# EAGLE schematic star-tracker-card (EAGLE 9.6.1)

## Sheet 1 of 5: Connectors
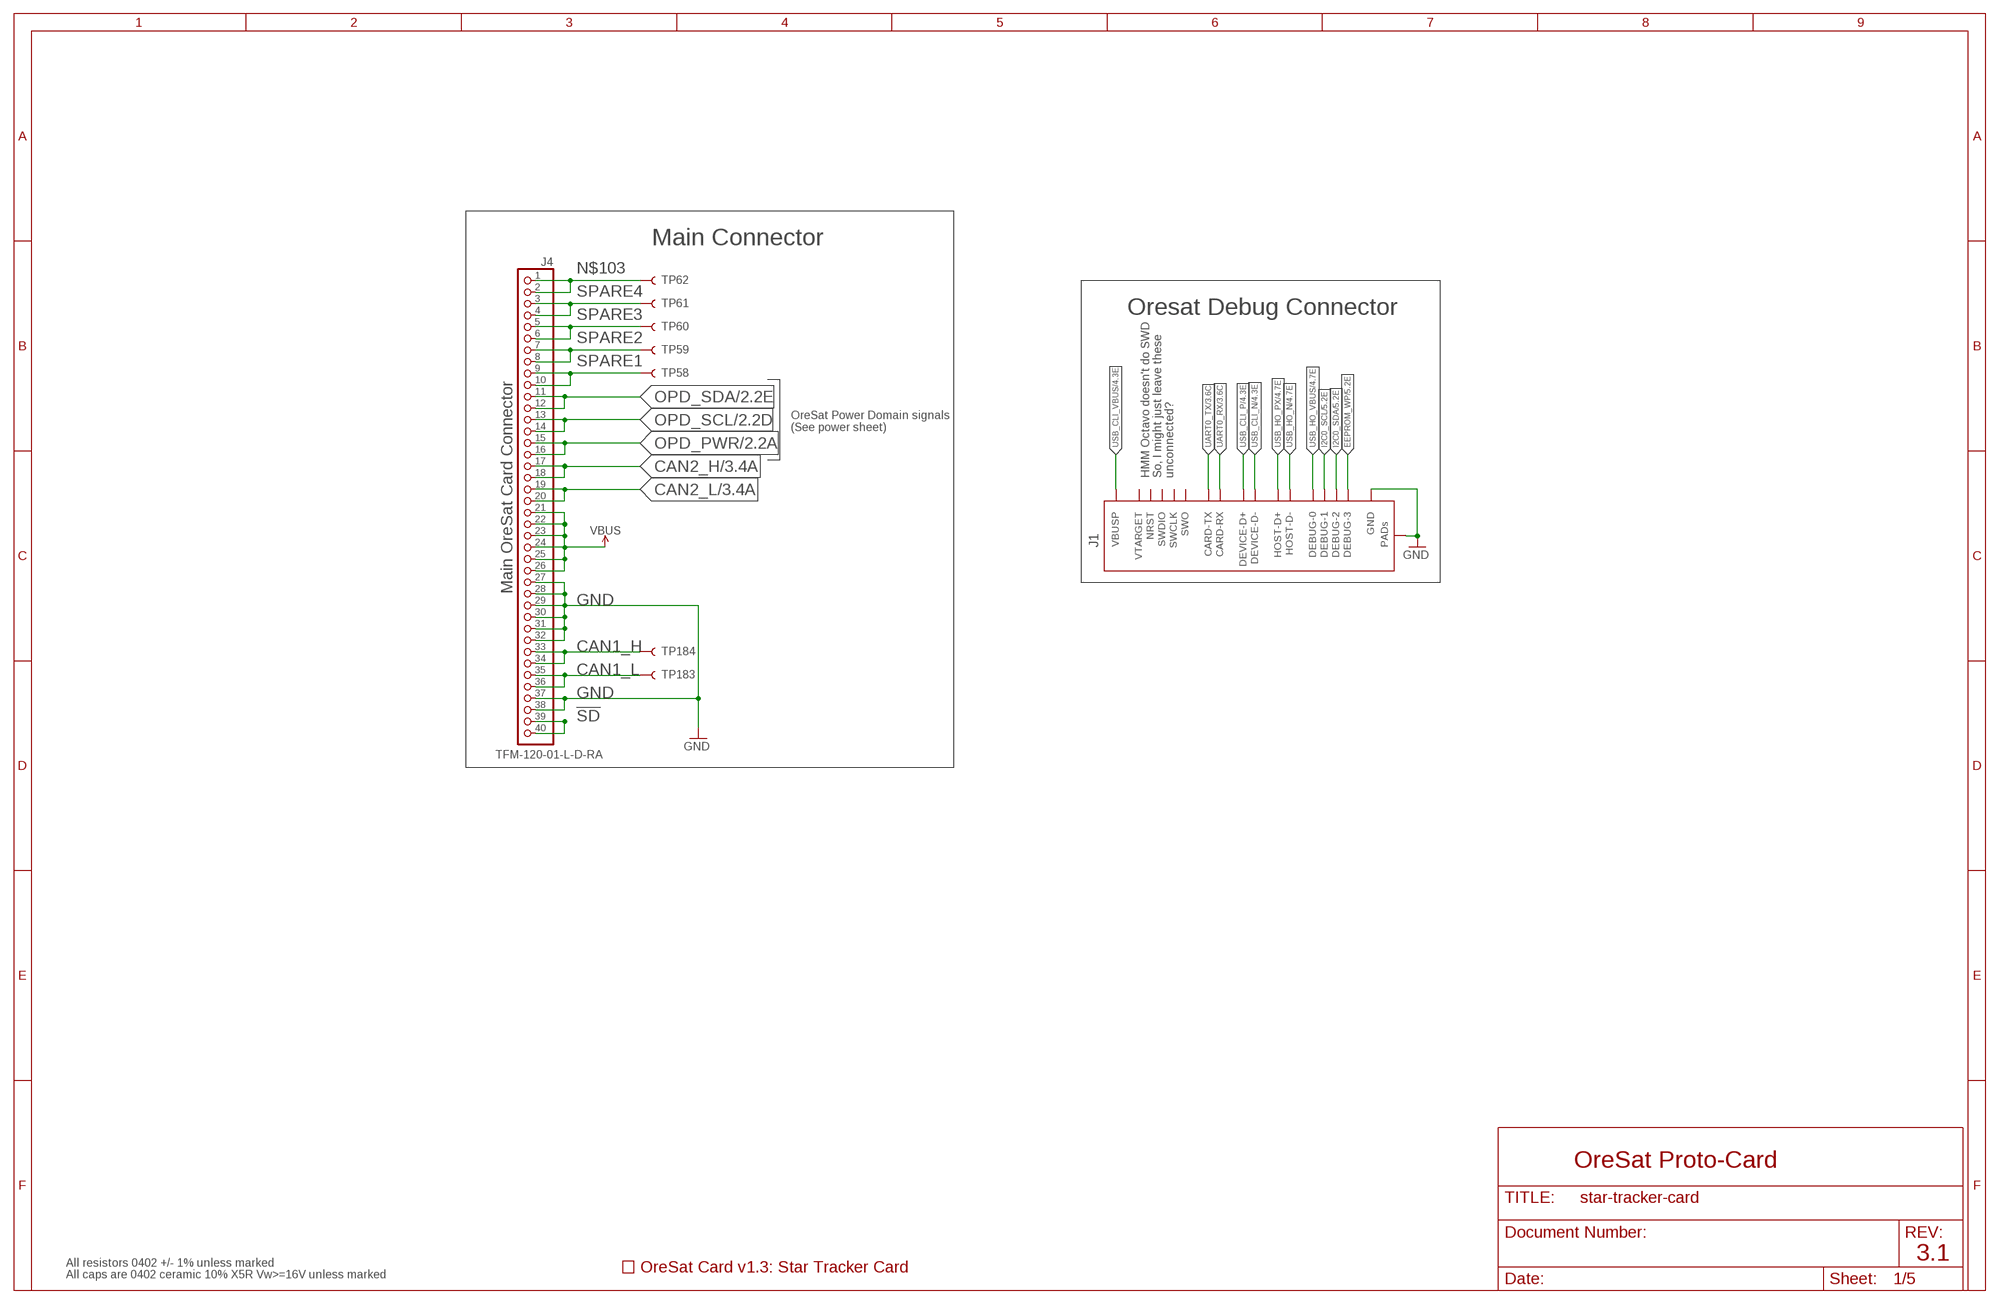
[diagram p0: schematic, sheet 1]

### Parts
J1  ORESAT-DEBUG-CONNECTOR-CARD  [TE_2-1734592-0]
J4  TFM-120-01-L-D-RA  J-SAMTEC-TFM-120-X1-XXX-D-RA  [J-SAMTEC-TFM-120-X1-XXX-D-RA]
PCB1  ORESAT-CARD-V1.3-STAR-TRACKER  [ORESAT-CARD-V1.3-STAR-TRACKER]
TP58  TEST-POINT3X4  [PAD.03X.04]
TP59  TEST-POINT3X4  [PAD.03X.04]
TP60  TEST-POINT3X4  [PAD.03X.04]
TP61  TEST-POINT3X4  [PAD.03X.04]
TP62  TEST-POINT3X4  [PAD.03X.04]
TP183  TEST-POINT3X4  [PAD.03X.04]
TP184  TEST-POINT3X4  [PAD.03X.04]

### Nets
!SD: J4.39 J4.40
CAN1_H: J4.33 J4.34 TP184.P$1
CAN1_L: J4.35 J4.36 TP183.P$1
CAN2_H: J4.17 J4.18 ; also sheet 3
CAN2_L: J4.19 J4.20 ; also sheet 3
EEPROM_WP: J1.20(DEBUG-3) ; also sheet 5
GND: J1.3(GND) J1.6(GND) J1.9(GND) J1.PAD1(PAD) J1.PAD2(PAD) J4.27 J4.28 J4.29 J4.30 J4.31 J4.32 J4.37 J4.38 ; also sheet 2,3,4,5
I2C0_SCL: J1.18(DEBUG-1) ; also sheet 5
I2C0_SDA: J1.19(DEBUG-2) ; also sheet 5
N$103: J4.1 J4.2 TP62.P$1
OPD_PWR: J4.15 J4.16 ; also sheet 2
OPD_SCL: J4.13 J4.14 ; also sheet 2
OPD_SDA: J4.11 J4.12 ; also sheet 2
SPARE1: J4.9 J4.10 TP58.P$1
SPARE2: J4.7 J4.8 TP59.P$1
SPARE3: J4.5 J4.6 TP60.P$1
SPARE4: J4.3 J4.4 TP61.P$1
UART0_RX: J1.12(CARD-RX) ; also sheet 3
UART0_TX: J1.13(CARD-TX) ; also sheet 3
USB_CLI_N: J1.5(DEVICE-D-) ; also sheet 4
USB_CLI_P: J1.4(DEVICE-D+) ; also sheet 4
USB_CLI_VBUS: J1.1(VBUSP) J1.2(VBUSP) ; also sheet 4
USB_HO_N: J1.8(HOST-D-) ; also sheet 4
USB_HO_PX: J1.7(HOST-D+) ; also sheet 4
USB_HO_VBUS: J1.17(DEBUG-0) ; also sheet 4
VBUS: J4.21 J4.22 J4.23 J4.24 J4.25 J4.26 ; also sheet 2
Unconnected: J1.10(NRST) J1.11(VTARGET) J1.14(SWDIO) J1.15(SWCLK) J1.16(SWO)

### Notes on the sheet
- Main Connector
- Oresat Debug Connector
- OreSat Power Domain signals
  (See power sheet)
- HMM Octavo doesn't do SWD
  So, I might just leave these 
  unconnected?
- Main OreSat Card Connector
- OreSat Proto-Card
- 3.1
- All resistors 0402 +/- 1% unless marked
- All caps are 0402 ceramic 10% X5R Vw>=16V unless marked

## Sheet 2 of 5: Power
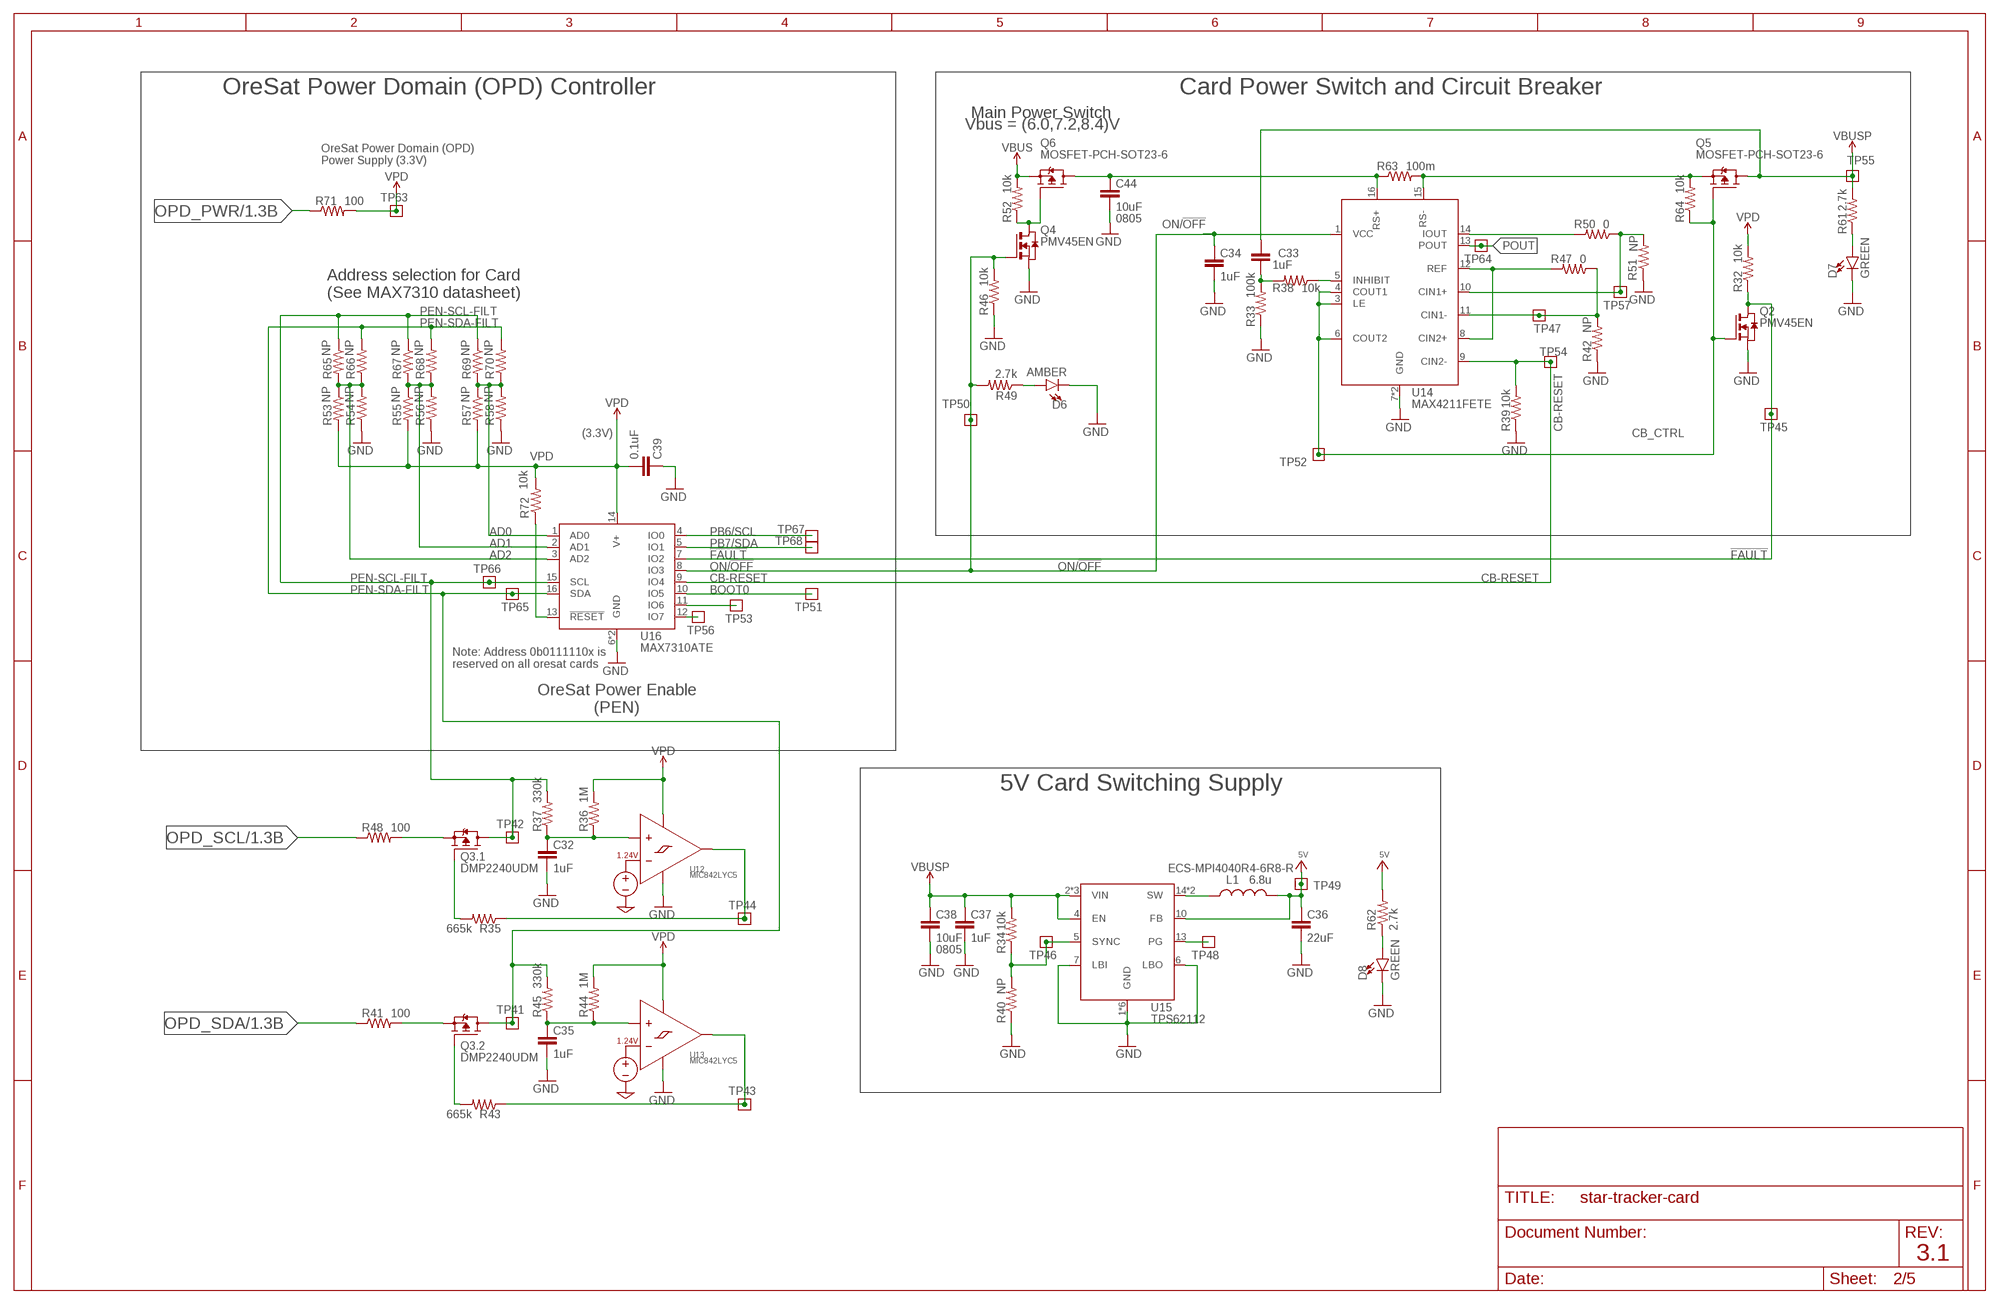
[diagram p1: schematic, sheet 2]

### Parts
C32  1uF  C-EU0805-B-NOSILK  [.0805-B-NOSILK]
C33  1uF  C-EU0603-A  [.0603-A]
C34  1uF  C-EU0603-A  [.0603-A]
C35  1uF  C-EU0805-B-NOSILK  [.0805-B-NOSILK]
C36  22uF  C-EUC1210  [C1210]
C37  1uF  C-EU0603-A  [.0603-A]
C38  10uF  C-EU0805-B  [.0805-B]
C39  0.1uF  C-EU0603-A  [.0603-A]
C44  10uF  C-EU0805-B  [.0805-B]
D6  AMBER  LED-GREEN0603  [LED-0603]
D7  GREEN  LED-GREEN0603  [LED-0603]
D8  GREEN  LED-GREEN0603  [LED-0603]
L1  6.8u  L-ECS-MPI4040  [ECS-MPI4040]
Q2  PMV45EN  [SOT23]
Q3  DMP2240UDM  MOSFET-PCH-SOT23-6  [SOT23-6]
Q4  PMV45EN  [SOT23]
Q5  MOSFET-PCH-SOT23-6  [SOT23-6]
Q6  MOSFET-PCH-SOT23-6  [SOT23-6]
R32  10k  R-US_0603-A  [.0603-A]
R33  100k  R-US_0603-A  [.0603-A]
R34  10k  R-US_0603-A  [.0603-A]
R35  665k  R-US_0603-A  [.0603-A]
R36  1M  R-US_0603-A  [.0603-A]
R37  330k  R-US_0603-A  [.0603-A]
R38  10k  R-US_0603-A  [.0603-A]
R39  10k  R-US_0603-A  [.0603-A]
R40  NP  R-US_0603-A  [.0603-A]
R41  100  R-US_0603-A  [.0603-A]
R42  NP  R-US_0603-A  [.0603-A]
R43  665k  R-US_0603-A  [.0603-A]
R44  1M  R-US_0603-A  [.0603-A]
R45  330k  R-US_0603-A  [.0603-A]
R46  10k  R-US_0603-A  [.0603-A]
R47  0  R-US_0603-A  [.0603-A]
R48  100  R-US_0603-A  [.0603-A]
R49  2.7k  R-US_0603-A  [.0603-A]
R50  0  R-US_0603-A  [.0603-A]
R51  NP  R-US_0603-A  [.0603-A]
R52  10k  R-US_0603-A  [.0603-A]
R53  NP  R-US_0603-A  [.0603-A]
R54  NP  R-US_0603-A  [.0603-A]
R55  NP  R-US_0603-A  [.0603-A]
R56  NP  R-US_0603-A  [.0603-A]
R57  NP  R-US_0603-A  [.0603-A]
R58  NP  R-US_0603-A  [.0603-A]
R61  2.7k  R-US_0603-A  [.0603-A]
R62  2.7k  R-US_0603-A  [.0603-A]
R63  100m  R-US_R1206  [R1206]
R64  10k  R-US_0603-A  [.0603-A]
R65  NP  R-US_0603-A  [.0603-A]
R66  NP  R-US_0603-A  [.0603-A]
R67  NP  R-US_0603-A  [.0603-A]
R68  NP  R-US_0603-A  [.0603-A]
R69  NP  R-US_0603-A  [.0603-A]
R70  NP  R-US_0603-A  [.0603-A]
R71  100  R-US_0603-A  [.0603-A]
R72  10k  R-US_0603-A  [.0603-A]
TP41  TEST-POINT  [2MM-TEST-POINT]
TP42  TEST-POINT  [2MM-TEST-POINT]
TP43  TEST-POINT  [2MM-TEST-POINT]
TP44  TEST-POINT  [2MM-TEST-POINT]
TP45  TEST-POINT  [2MM-TEST-POINT]
TP46  TEST-POINT  [2MM-TEST-POINT]
TP47  TEST-POINT  [2MM-TEST-POINT]
TP48  TEST-POINT  [2MM-TEST-POINT]
TP49  TEST-POINT  [2MM-TEST-POINT]
TP50  TEST-POINT  [2MM-TEST-POINT]
TP51  TEST-POINT  [2MM-TEST-POINT]
TP52  TEST-POINT  [2MM-TEST-POINT]
TP53  TEST-POINT  [2MM-TEST-POINT]
TP54  TEST-POINT  [2MM-TEST-POINT]
TP55  TEST-POINT  [2MM-TEST-POINT]
TP56  TEST-POINT  [2MM-TEST-POINT]
TP57  TEST-POINT  [2MM-TEST-POINT]
TP63  TEST-POINT  [2MM-TEST-POINT]
TP64  TEST-POINT  [2MM-TEST-POINT]
TP65  TEST-POINT  [2MM-TEST-POINT]
TP66  TEST-POINT  [2MM-TEST-POINT]
TP67  TEST-POINT  [2MM-TEST-POINT]
TP68  TEST-POINT  [2MM-TEST-POINT]
U12  MIC842LYC5  [SC70-5]
U13  MIC842LYC5  [SC70-5]
U14  MAX4211FETE  MAX4211  [QFN65P400X400X80-17T210]
U15  TPS62112  TPS6211X  [S-PVQFN-16]
U16  MAX7310ATE  MAX7310  [QFN65P400X400X80-17T210]

### Nets
5V: C36.1 L1.2 R62.2 TP49.1 U15.10(FB) ; also sheet 5
!FAULT: Q2.3(D) R32.1 TP45.1 U16.7(IO2)
AD0: R57.1 R58.2 R69.2 R70.1 U16.1(AD0)
AD1: R55.1 R56.2 R67.2 R68.1 U16.2(AD1)
AD2: R53.1 R54.2 R65.2 R66.1 U16.3(AD2)
BOOT0: TP51.1 U16.10(IO5)
CB-RESET: R39.2 TP54.1 U14.9(CIN2-) U16.9(IO4)
CB_CTRL: Q2.1(G) Q5.3(G) R64.1 TP52.1 U14.3(LE) U14.4(COUT1) U14.6(COUT2)
GND: C32.2 C34.2 C35.2 C36.2 C37.2 C38.2 C39.1 C44.2 D6.C D7.C D8.C Q2.2(S) Q4.2(S) R33.1 R39.1 R40.1 R42.1 R46.1 R51.1 R54.1 R56.1 R58.1 U12.2(GND) U13.2(GND) U14.7(GND) U14.EPAD(GND) U15.1(GND) U15.6(LBO) U15.7(LBI) U15.9(GND) U15.11(GND) U15.12(GND) U15.16(GND) U15.PAD(GND) U16.6(GND) U16.EPAD(GND) ; also sheet 1,3,4,5
IOUT: R50.2 U14.14(IOUT)
N$25: C32.1 R36.1 R37.1 U12.1(INP)
N$27: R35.1 TP44.1 U12.4(OUT)
N$32: TP56.1 U16.12(IO7)
N$98: C44.1 Q6.1(D) Q6.2(D) Q6.5(D) Q6.6(D) R63.1 U14.16(RS+)
N$99: Q5.4(S) R63.2 R64.2 U14.15(RS-)
N$100: C35.1 R44.1 R45.1 U13.1(INP)
N$113: Q3.3(.2:G) R43.2
N$117: Q3.1(.1:G) R35.2
N$270: D7.A R61.1
N$271: D8.A R62.1
N$385: TP53.1 U16.11(IO6)
N$479: Q3.5(.1:S) R48.2
N$575: D6.A R49.1
N$579: Q3.2(.2:S) R41.2
N$580: R43.1 TP43.1 U13.4(OUT)
N$589: R72.1 U16.13(!RESET)
N$590: Q4.3(D) Q6.3(G) R52.1
N$596: R50.1 R51.2 TP57.1 U14.10(CIN1+)
N$597: R42.2 R47.1 TP47.1 U14.11(CIN1-)
N$599: R47.2 U14.8(CIN2+) U14.12(REF)
N$603: C33.1 R33.2 R38.2
N$604: R38.1 U14.5(INHIBIT)
ON/!OFF: C34.1 Q4.1(G) R46.2 R49.2 TP50.1 U14.1(VCC) U16.8(IO3)
OPD_PWR: R71.1 ; also sheet 1
OPD_SCL: R48.1 ; also sheet 1
OPD_SDA: R41.1 ; also sheet 1
PB6/SCL: TP67.1 U16.4(IO0)
PB7/SDA: TP68.1 U16.5(IO1)
PEN-SCL-FILT: Q3.6(.1:D) R37.2 R65.1 R67.1 R69.1 TP42.1 TP66.1 U16.15(SCL)
PEN-SDA-FILT: Q3.4(.2:D) R45.2 R66.2 R68.2 R70.2 TP41.1 TP65.1 U16.16(SDA)
POUT: TP64.1 U14.13(POUT)
TPS62111-PG: TP48.1 U15.13(PG)
TPS62111-SYNC: R34.1 R40.2 TP46.1 U15.5(SYNC)
TPS62111_SW: L1.1 U15.14(SW) U15.15(SW)
VBUS: Q6.4(S) R52.2 ; also sheet 1
VBUSP: C33.2 C37.1 C38.1 Q5.1(D) Q5.2(D) Q5.5(D) Q5.6(D) R34.2 R61.2 TP55.1 U15.2(VIN) U15.3(VIN) U15.4(EN) U15.8(VIN)
VPD: C39.2 R32.2 R36.2 R44.2 R53.2 R55.2 R57.2 R71.2 R72.2 TP63.1 U12.5(VDD) U13.5(VDD) U16.14(V+)

### Notes on the sheet
- OreSat Power Domain (OPD) Controller | Card Power Switch and Circuit Breaker
- Main Power Switch
- Vbus = (6.0,7.2,8.4)V
- OreSat Power Domain (OPD)
  Power Supply (3.3V)
- 0805
- Address selection for Card
  (See MAX7310 datasheet)
- (3.3V)
- Note: Address 0b0111110x is 
  reserved on all oresat cards
- OreSat Power Enable
  (PEN)
- 5V Card Switching Supply
- ECS-MPI4040R4-6R8-R
- 0805
- 3.1

## Sheet 3 of 5: OSD3358 SD, eMMC, Camera, etc : SIP C, D
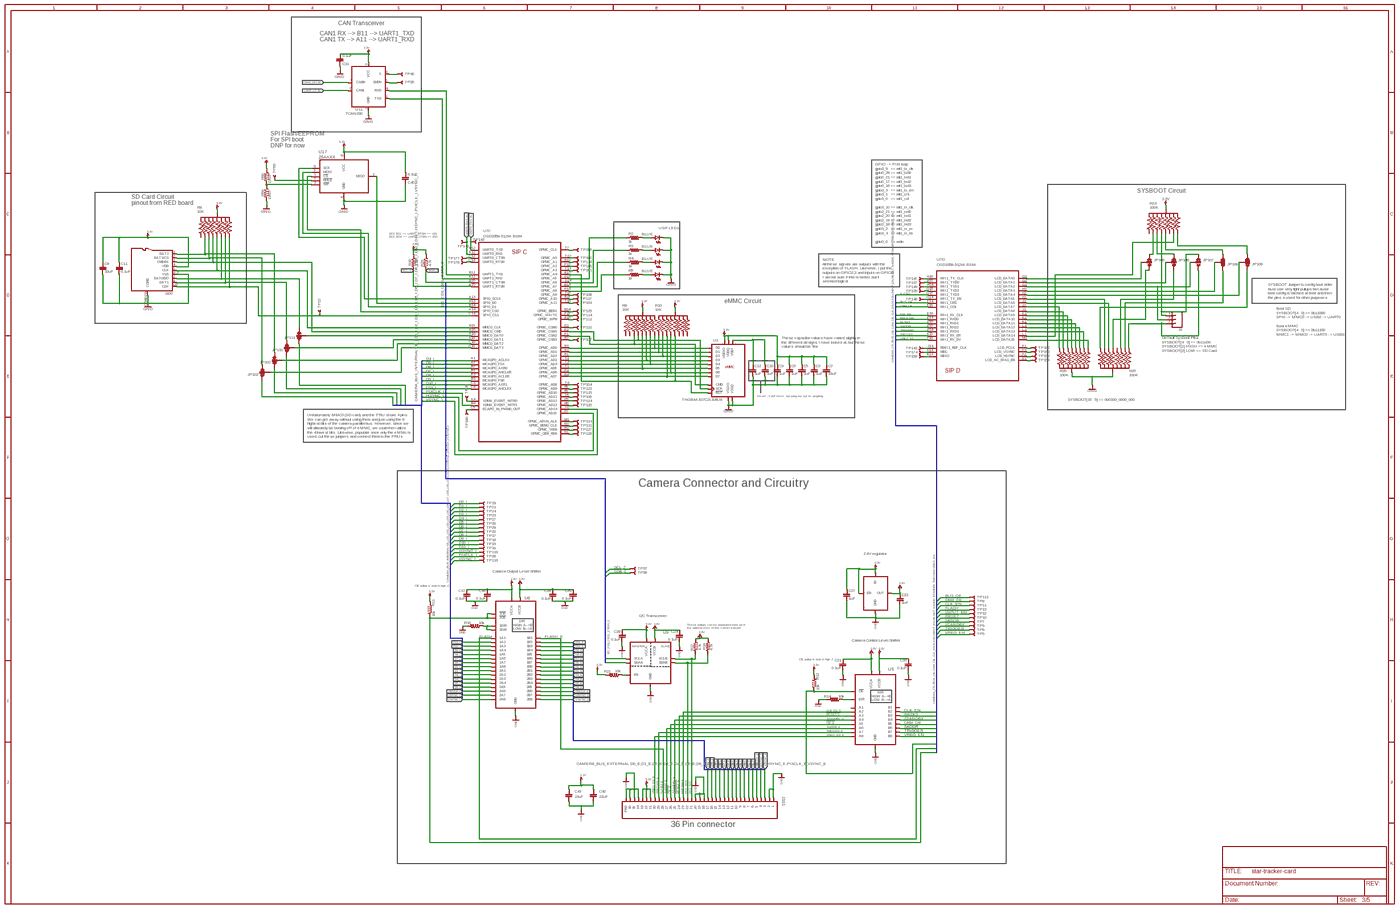
[diagram p2: schematic, sheet 3, overview]
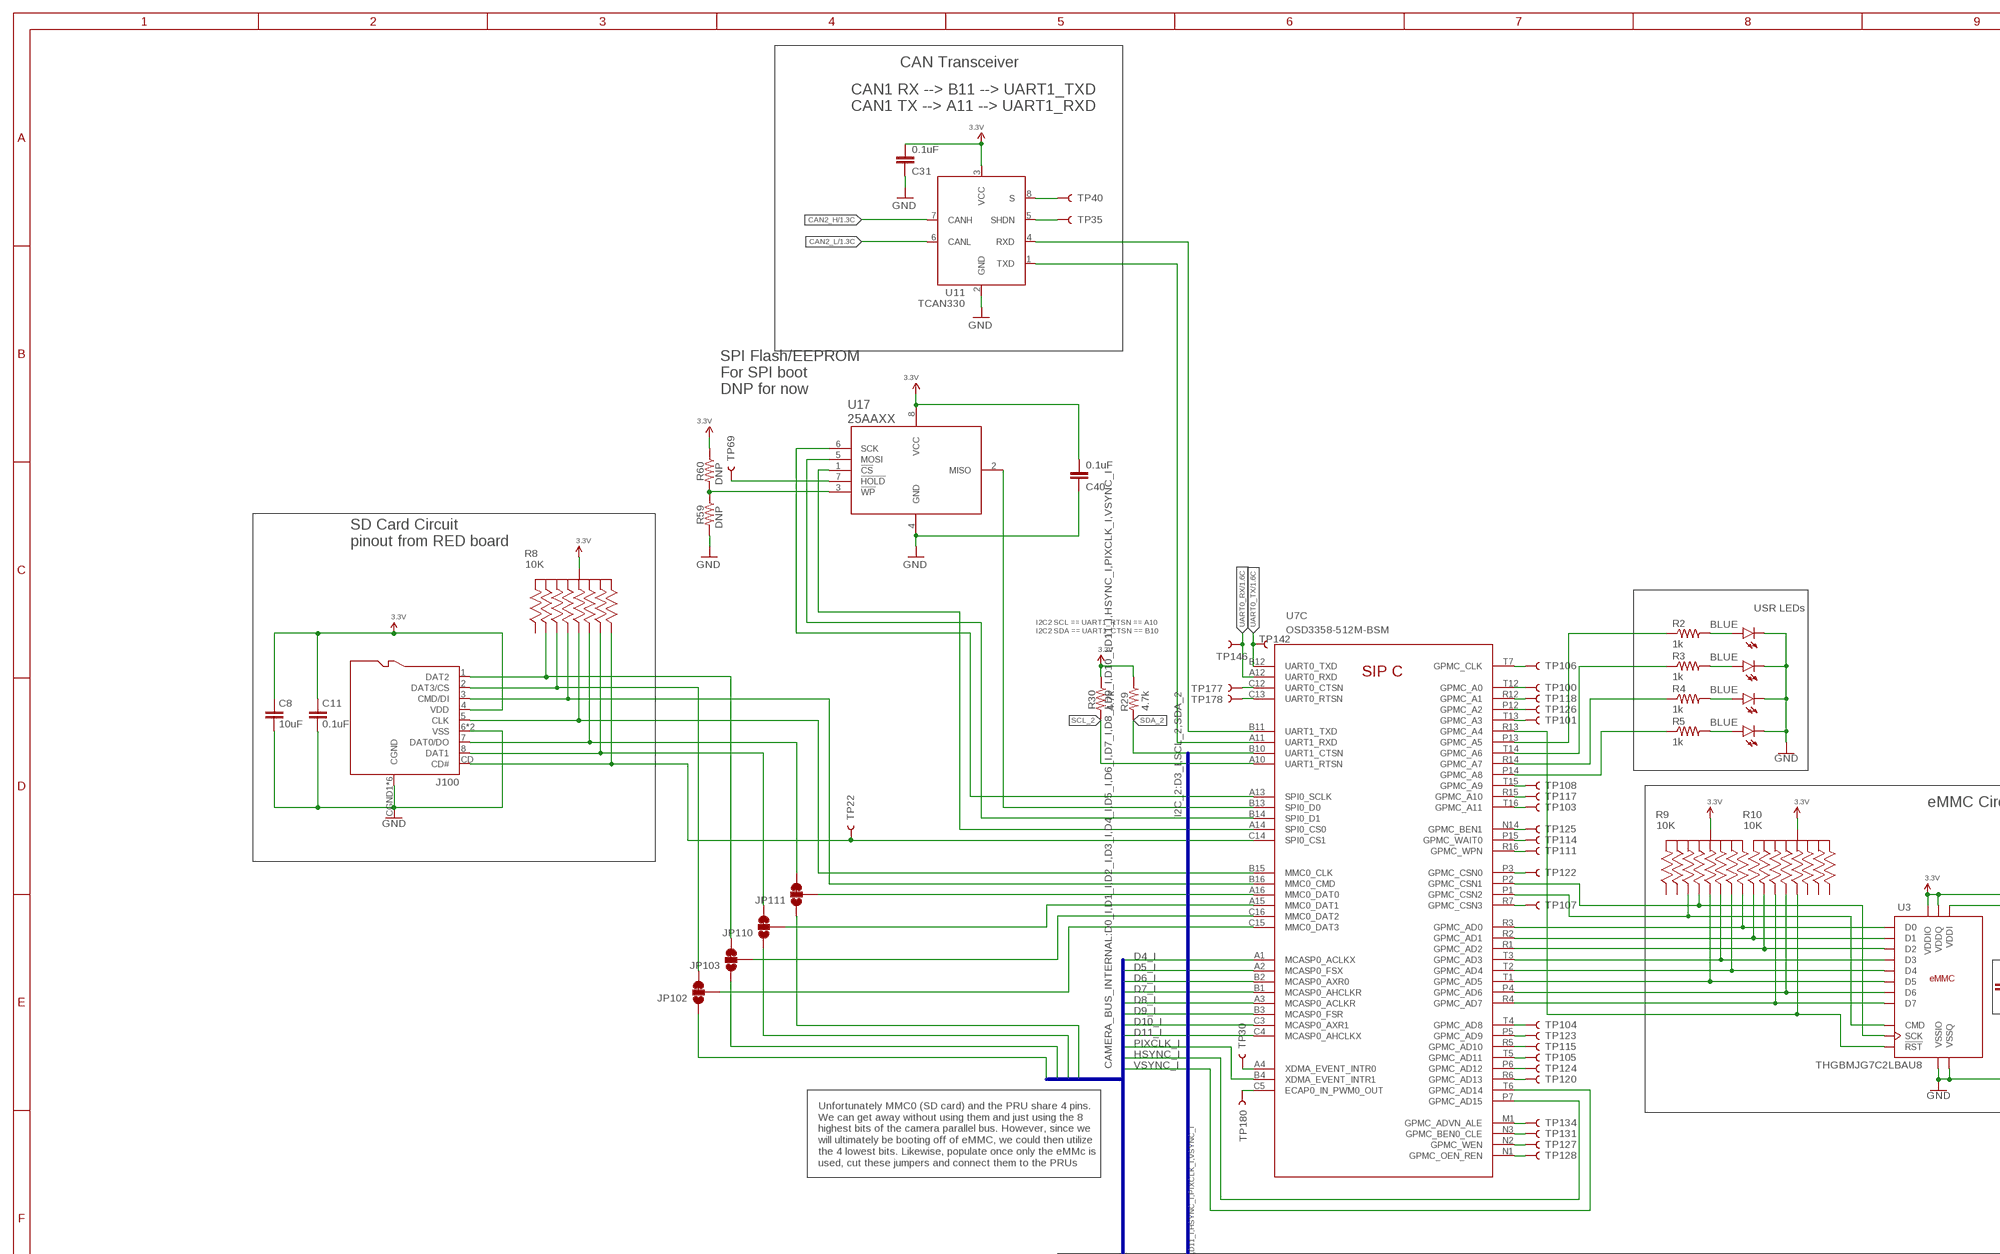
[diagram p3: schematic, sheet 3, part 1 of 4]
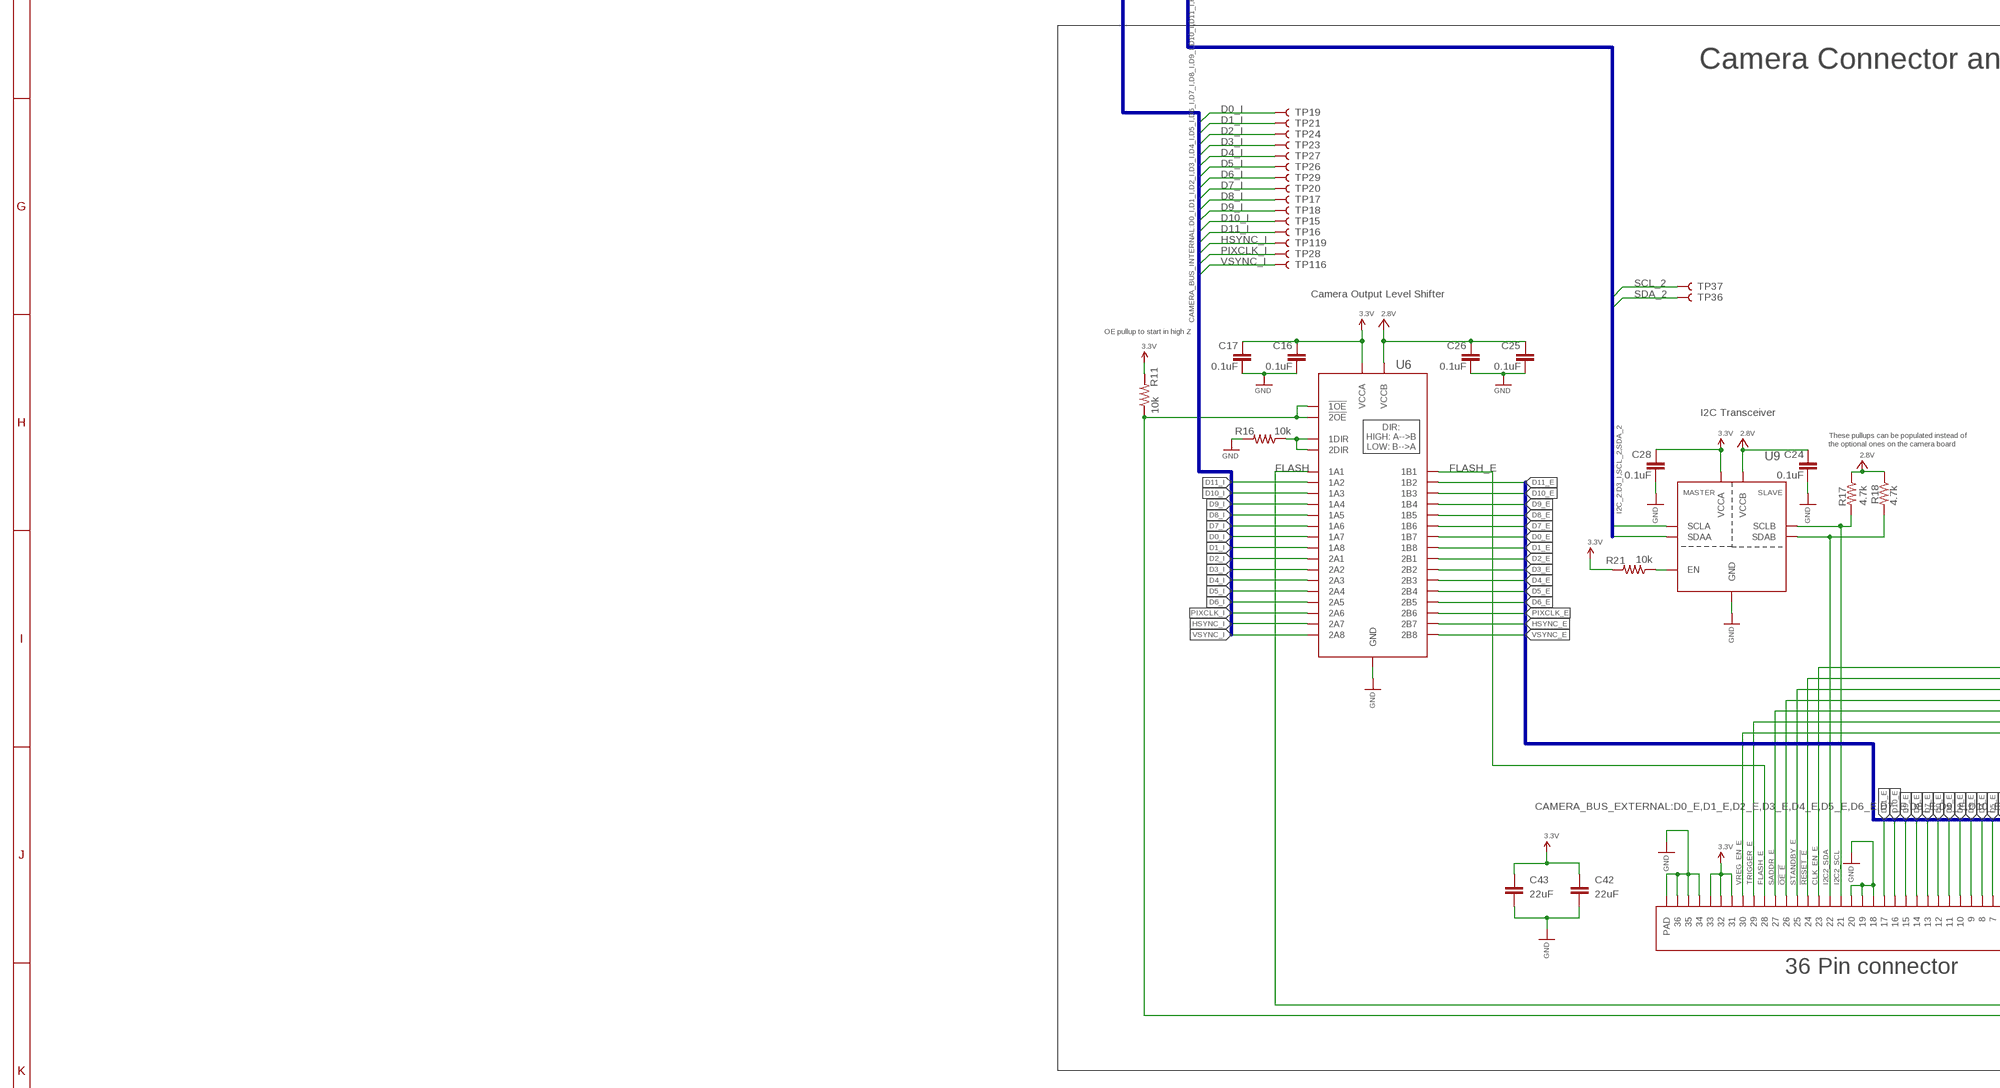
[diagram p4: schematic, sheet 3, part 2 of 4]
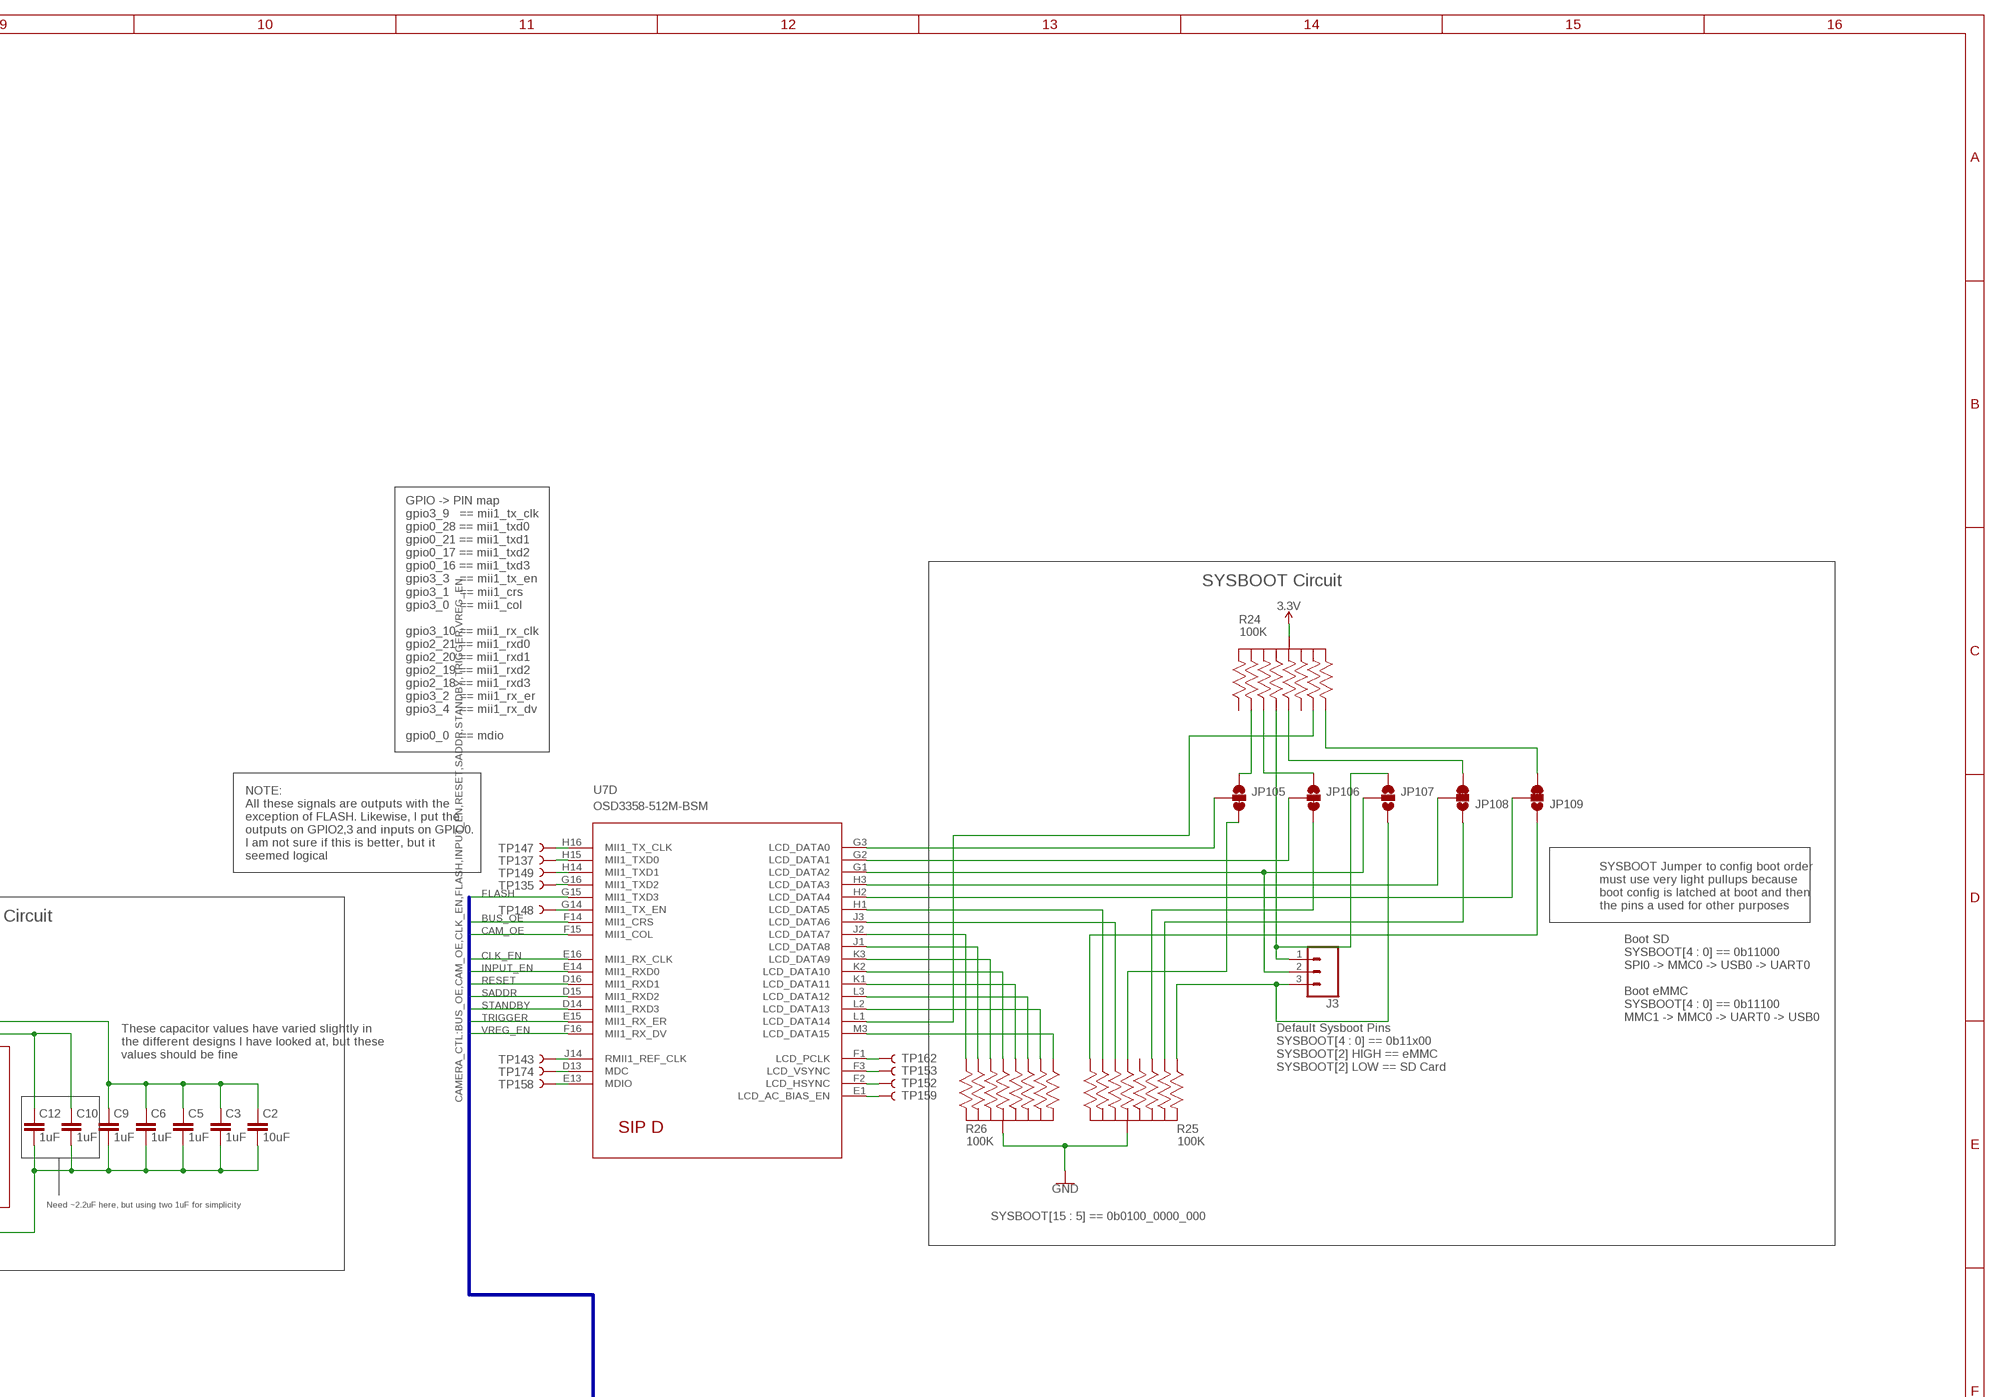
[diagram p5: schematic, sheet 3, part 3 of 4]
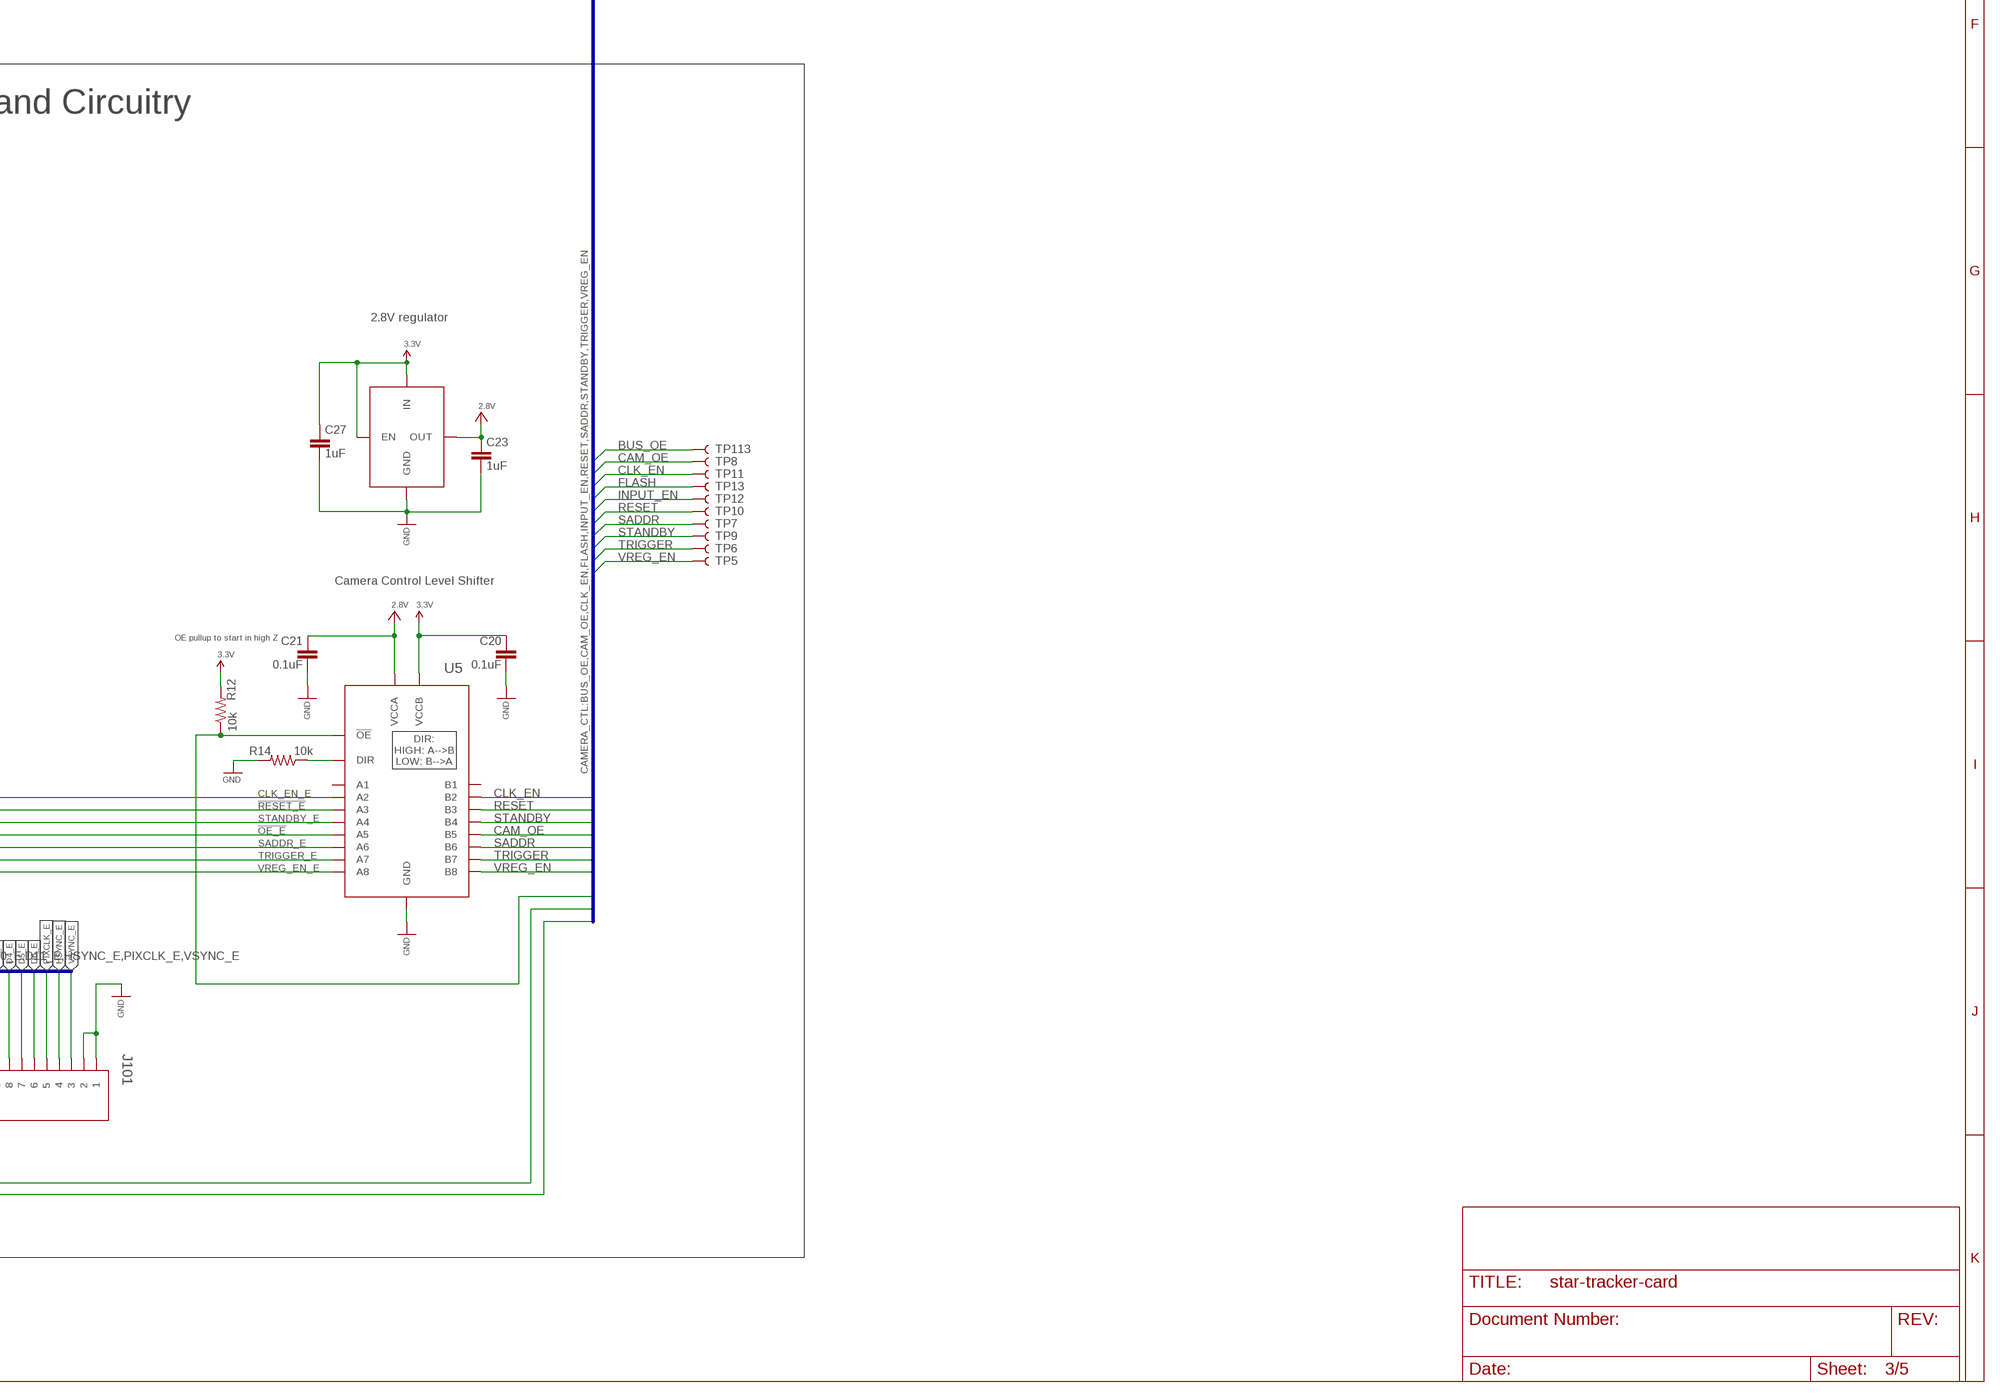
[diagram p6: schematic, sheet 3, part 4 of 4]

### Parts
C2  10uF  C-EU0805-B  [.0805-B]
C3  1uF  C-EU0603-A  [.0603-A]
C5  1uF  C-EU0603-A  [.0603-A]
C6  1uF  C-EU0603-A  [.0603-A]
C8  10uF  C-EU0805-B  [.0805-B]
C9  1uF  C-EU0603-A  [.0603-A]
C10  1uF  C-EU0603-A  [.0603-A]
C11  0.1uF  C-EU0603-A  [.0603-A]
C12  1uF  C-EU0603-A  [.0603-A]
C16  0.1uF  C-EU0603-A  [.0603-A]
C17  0.1uF  C-EU0603-A  [.0603-A]
C20  0.1uF  C-EU0603-A  [.0603-A]
C21  0.1uF  C-EU0603-A  [.0603-A]
C23  1uF  C-EU0603-A  [.0603-A]
C24  0.1uF  C-EU0603-A  [.0603-A]
C25  0.1uF  C-EU0603-A  [.0603-A]
C26  0.1uF  C-EU0603-A  [.0603-A]
C27  1uF  C-EU0603-A  [.0603-A]
C28  0.1uF  C-EU0603-A  [.0603-A]
C31  0.1uF  C-EU0603-A  [.0603-A]
C40  0.1uF  C-EU0603-A  [.0603-A]
C42  22uF  C-EUC1210  [C1210]
C43  22uF  C-EUC1210  [C1210]
D2  BLUE  LED-BLUE0603  [LED-0603]
D3  BLUE  LED-BLUE0603  [LED-0603]
D4  BLUE  LED-BLUE0603  [LED-0603]
D5  BLUE  LED-BLUE0603  [LED-0603]
J3  CONN_03LONGPADS  [1X03_LONGPADS]
J100  DM3BT-DSF-PEJS  [DM3BT-DSF-PEJS]
J101  3-1734592-64-1734592-0  [TE_3-1734592-6]
JP102  JUMPER-SMT_3_1-NC_TRACE_SILK  [SMT-JUMPER_3_1-NC_TRACE_SILK]
JP103  JUMPER-SMT_3_1-NC_TRACE_SILK  [SMT-JUMPER_3_1-NC_TRACE_SILK]
JP105  JUMPER-SMT_3_1-NC_TRACE_SILK  [SMT-JUMPER_3_1-NC_TRACE_SILK]
JP106  JUMPER-SMT_3_1-NC_TRACE_SILK  [SMT-JUMPER_3_1-NC_TRACE_SILK]
JP107  JUMPER-SMT_3_NO_SILK  [SMT-JUMPER_3_NO_SILK]
JP108  JUMPER-SMT_3_1-NC_TRACE_SILK  [SMT-JUMPER_3_1-NC_TRACE_SILK]
JP109  JUMPER-SMT_3_1-NC_TRACE_SILK  [SMT-JUMPER_3_1-NC_TRACE_SILK]
JP110  JUMPER-SMT_3_1-NC_TRACE_SILK  [SMT-JUMPER_3_1-NC_TRACE_SILK]
JP111  JUMPER-SMT_3_1-NC_TRACE_SILK  [SMT-JUMPER_3_1-NC_TRACE_SILK]
R2  1k  R-US_0603-A  [.0603-A]
R3  1k  R-US_0603-A  [.0603-A]
R4  1k  R-US_0603-A  [.0603-A]
R5  1k  R-US_0603-A  [.0603-A]
R8  10K  EXB-A10P391JC_ARRAY_EXBA-M  [ARRAY_EXBA-M]
R9  10K  EXB-A10P391JC_ARRAY_EXBA-M  [ARRAY_EXBA-M]
R10  10K  EXB-A10P391JC_ARRAY_EXBA-M  [ARRAY_EXBA-M]
R11  10k  R-US_0603-A  [.0603-A]
R12  10k  R-US_0603-A  [.0603-A]
R14  10k  R-US_0603-A  [.0603-A]
R16  10k  R-US_0603-A  [.0603-A]
R17  4.7k  R-US_0603-A  [.0603-A]
R18  4.7k  R-US_0603-A  [.0603-A]
R21  10k  R-US_0603-A  [.0603-A]
R24  100K  EXB-A10P391JC_ARRAY_EXBA-M  [ARRAY_EXBA-M]
R25  100K  EXB-A10P391JC_ARRAY_EXBA-M  [ARRAY_EXBA-M]
R26  100K  EXB-A10P391JC_ARRAY_EXBA-M  [ARRAY_EXBA-M]
R29  4.7k  R-US_0603-A  [.0603-A]
R30  4.7k  R-US_0603-A  [.0603-A]
R59  DNP  R-US_0603-A  [.0603-A]
R60  DNP  R-US_0603-A  [.0603-A]
TP5  TEST-POINT3X4  [PAD.03X.04]
TP6  TEST-POINT3X4  [PAD.03X.04]
TP7  TEST-POINT3X4  [PAD.03X.04]
TP8  TEST-POINT3X4  [PAD.03X.04]
TP9  TEST-POINT3X4  [PAD.03X.04]
TP10  TEST-POINT3X4  [PAD.03X.04]
TP11  TEST-POINT3X4  [PAD.03X.04]
TP12  TEST-POINT3X4  [PAD.03X.04]
TP13  TEST-POINT3X4  [PAD.03X.04]
TP15  TEST-POINT3X4  [PAD.03X.04]
TP16  TEST-POINT3X4  [PAD.03X.04]
TP17  TEST-POINT3X4  [PAD.03X.04]
TP18  TEST-POINT3X4  [PAD.03X.04]
TP19  TEST-POINT3X4  [PAD.03X.04]
TP20  TEST-POINT3X4  [PAD.03X.04]
TP21  TEST-POINT3X4  [PAD.03X.04]
TP22  TEST-POINT3X4  [PAD.03X.04]
TP23  TEST-POINT3X4  [PAD.03X.04]
TP24  TEST-POINT3X4  [PAD.03X.04]
TP26  TEST-POINT3X4  [PAD.03X.04]
TP27  TEST-POINT3X4  [PAD.03X.04]
TP28  TEST-POINT3X4  [PAD.03X.04]
TP29  TEST-POINT3X4  [PAD.03X.04]
TP30  TEST-POINT3X4  [PAD.03X.04]
TP35  TEST-POINT3X4  [PAD.03X.04]
TP36  TEST-POINT3X4  [PAD.03X.04]
TP37  TEST-POINT3X4  [PAD.03X.04]
TP40  TEST-POINT3X4  [PAD.03X.04]
TP69  TEST-POINT3X4  [PAD.03X.04]
TP100  TEST-POINT3X4  [PAD.03X.04]
TP101  TEST-POINT3X4  [PAD.03X.04]
TP103  TEST-POINT3X4  [PAD.03X.04]
TP104  TEST-POINT3X4  [PAD.03X.04]
TP105  TEST-POINT3X4  [PAD.03X.04]
TP106  TEST-POINT3X4  [PAD.03X.04]
TP107  TEST-POINT3X4  [PAD.03X.04]
TP108  TEST-POINT3X4  [PAD.03X.04]
TP111  TEST-POINT3X4  [PAD.03X.04]
TP113  TEST-POINT3X4  [PAD.03X.04]
TP114  TEST-POINT3X4  [PAD.03X.04]
TP115  TEST-POINT3X4  [PAD.03X.04]
TP116  TEST-POINT3X4  [PAD.03X.04]
TP117  TEST-POINT3X4  [PAD.03X.04]
TP118  TEST-POINT3X4  [PAD.03X.04]
TP119  TEST-POINT3X4  [PAD.03X.04]
TP120  TEST-POINT3X4  [PAD.03X.04]
TP122  TEST-POINT3X4  [PAD.03X.04]
TP123  TEST-POINT3X4  [PAD.03X.04]
TP124  TEST-POINT3X4  [PAD.03X.04]
TP125  TEST-POINT3X4  [PAD.03X.04]
TP126  TEST-POINT3X4  [PAD.03X.04]
TP127  TEST-POINT3X4  [PAD.03X.04]
TP128  TEST-POINT3X4  [PAD.03X.04]
TP131  TEST-POINT3X4  [PAD.03X.04]
TP134  TEST-POINT3X4  [PAD.03X.04]
TP135  TEST-POINT3X4  [PAD.03X.04]
TP137  TEST-POINT3X4  [PAD.03X.04]
TP142  TEST-POINT3X4  [PAD.03X.04]
TP143  TEST-POINT3X4  [PAD.03X.04]
TP146  TEST-POINT3X4  [PAD.03X.04]
TP147  TEST-POINT3X4  [PAD.03X.04]
TP148  TEST-POINT3X4  [PAD.03X.04]
TP149  TEST-POINT3X4  [PAD.03X.04]
TP152  TEST-POINT3X4  [PAD.03X.04]
TP153  TEST-POINT3X4  [PAD.03X.04]
TP158  TEST-POINT3X4  [PAD.03X.04]
TP159  TEST-POINT3X4  [PAD.03X.04]
TP162  TEST-POINT3X4  [PAD.03X.04]
TP174  TEST-POINT3X4  [PAD.03X.04]
TP177  TEST-POINT3X4  [PAD.03X.04]
TP178  TEST-POINT3X4  [PAD.03X.04]
TP180  TEST-POINT3X4  [PAD.03X.04]
U3  THGBMJG7C2LBAU8  EMMC+RESET+5.1-COMPATIBLE-BA  [BGA-153(11.5X13)(EMMC-BA)]
U5  SN74LVC8T245MPWREPPW24-M  [PW24-M]
U6  CLVCH16T245MDGGREP  [DGG48-M]
U7  OSD3358-512M-BSM  [OSD335X-BGA-256]
U8  TLV70028QDDCRQ1  [SOT23-5]
U9  TCA9509DGKRDGK8-M  [DGK8-M]
U11  TCAN330  [SOT23-8_TI-DCN]
U17  25AAXX  [SOIC8]

### Nets
2.8V: C21.1 C23.1 C24.1 C25.1 C26.1 R17.1 R18.1 U5.1(VCCA) U6.7(VCCB) U6.18(VCCB) U8.5(OUT) U9.8(VCCB)
3.3V: C2.1 C3.1 C5.1 C6.1 C8.1 C9.1 C11.1 C16.1 C17.1 C20.1 C27.1 C28.1 C31.2 C40.2 C42.1 C43.1 J100.4(VDD) J101.31 J101.32 J101.33 R8.5 R8.10 R9.5 R9.10 R10.5 R10.10 R11.2 R12.2 R21.2 R24.5 R24.10 R29.1 R30.1 R60.1 U3.C6(VDDQ) U3.E6(VDDIO) U3.F5(VDDIO) U3.J10(VDDIO) U3.K9(VDDIO) U3.M4(VDDQ) U3.N4(VDDQ) U3.P3(VDDQ) U3.P5(VDDQ) U5.23(VCCB) U5.24(VCCB) U6.31(VCCA) U6.42(VCCA) U8.1(IN) U8.3(EN) U9.1(VCCA) U11.3(VCC) U17.8(VCC) ; also sheet 4,5
!OE_E: J101.26 U5.7(A5)
!RESET_E: J101.24 U5.5(A3)
BUS_OE: R11.1 TP113.P$1 U6.25(!2OE) U6.48(!1OE) U7.F14(D:MII1_CRS)
CAM_OE: TP8.P$1 U5.17(B5) U7.F15(D:MII1_COL)
CAN2_H: U11.7(CANH) ; also sheet 1
CAN2_L: U11.6(CANL) ; also sheet 1
CLK_EN: TP11.P$1 U5.20(B2) U7.E16(D:MII1_RX_CLK)
CLK_EN_E: J101.23 U5.4(A2)
D0_E: J101.12 U6.11(1B7)
D0_I: JP102.1 TP19.P$1 U6.38(1A7)
D1_E: J101.11 U6.12(1B8)
D1_I: JP103.1 TP21.P$1 U6.37(1A8)
D2_E: J101.10 U6.13(2B1)
D2_I: JP110.1 TP24.P$1 U6.36(2A1)
D3_E: J101.9 U6.14(2B2)
D3_I: JP111.1 TP23.P$1 U6.35(2A2)
D4_E: J101.8 U6.16(2B3)
D4_I: TP27.P$1 U6.33(2A3) U7.A1(C:MCASP0_ACLKX)
D5_E: J101.7 U6.17(2B4)
D5_I: TP26.P$1 U6.32(2A4) U7.A2(C:MCASP0_FSX)
D6_E: J101.6 U6.19(2B5)
D6_I: TP29.P$1 U6.30(2A5) U7.B2(C:MCASP0_AXR0)
D7_E: J101.13 U6.9(1B6)
D7_I: TP20.P$1 U6.40(1A6) U7.B1(C:MCASP0_AHCLKR)
D8_E: J101.14 U6.8(1B5)
D8_I: TP17.P$1 U6.41(1A5) U7.A3(C:MCASP0_ACLKR)
D9_E: J101.15 U6.6(1B4)
D9_I: TP18.P$1 U6.43(1A4) U7.B3(C:MCASP0_FSR)
D10_E: J101.16 U6.5(1B3)
D10_I: TP15.P$1 U6.44(1A3) U7.C3(C:MCASP0_AXR1)
D11_E: J101.17 U6.3(1B2)
D11_I: TP16.P$1 U6.46(1A2) U7.C4(C:MCASP0_AHCLKX)
FLASH: TP13.P$1 U6.47(1A1) U7.G15(D:MII1_TXD3)
FLASH_E: J101.28 U6.2(1B1)
GND: C2.2 C3.2 C5.2 C6.2 C8.2 C9.2 C10.2 C11.2 C12.2 C16.2 C17.2 C20.2 C21.2 C23.2 C24.2 C25.2 C26.2 C27.2 C28.2 C31.1 C40.1 C42.2 C43.2 D2.C D3.C D4.C D5.C J100.6(VSS) J100.CGND1(CGND) J100.CGND2(CGND) J100.CGND3(CGND) J100.CGND4(CGND) J100.CGND5(CGND) J100.CGND6(CGND) J100.GND(VSS) J101.1 J101.2 J101.18 J101.19 J101.20 J101.34 J101.35 J101.36 J101.S1(PAD) J101.S2(PAD) R14.2 R16.2 R25.5 R25.10 R26.5 R26.10 R59.2 U3.C4(VSSQ) U3.E7(VSSIO) U3.G5(VSSIO) U3.H10(VSSIO) U3.J5(VSSIO) U3.K8(VSSIO) U3.N2(VSSQ) U3.N5(VSSQ) U3.P4(VSSQ) U3.P6(VSSQ) U5.11(GND) U5.12(GND) U5.13(GND) U6.4(GND) U6.10(GND) U6.15(GND) U6.21(GND) U6.28(GND) U6.34(GND) U6.39(GND) U6.45(GND) U8.2(GND) U9.4(GND) U11.2(GND) U17.4(GND) ; also sheet 1,2,4,5
HSYNC_E: J101.4 U6.22(2B7)
HSYNC_I: TP119.P$1 U6.27(2A7) U7.P7(C:GPMC_AD15)
I2C2_SCL: J101.21 R17.2 U9.7(SCLB)
I2C2_SDA: J101.22 R18.2 U9.6(SDAB)
INPUT_EN: R12.1 TP12.P$1 U5.22(!OE) U7.E14(D:MII1_RXD0)
N$2: D5.A R5.2
N$4: J100.1(DAT2) JP103.3 R8.9
N$5: J100.2(DAT3/CS) JP102.3 R8.2
N$6: J100.3(CMD/DI) R8.8 U7.B16(C:MMC0_CMD)
N$7: J100.5(CLK) R8.3 U7.B15(C:MMC0_CLK)
N$8: J100.7(DAT0/DO) JP111.3 R8.7
N$9: J100.8(DAT1) JP110.3 R8.4
N$10: J100.CD(CD#) R8.6 TP22.P$1 U7.C14(C:SPI0_CS1)
N$11: U7.B11(C:UART1_TXD) U11.4(RXD)
N$12: U7.A11(C:UART1_RXD) U11.1(TXD)
N$13: TP40.P$1 U11.8(S)
N$14: TP35.P$1 U11.5(SHDN)
N$15: JP111.2 U7.A16(C:MMC0_DAT0)
N$16: JP110.2 U7.A15(C:MMC0_DAT1)
N$17: JP103.2 U7.C16(C:MMC0_DAT2)
N$18: JP102.2 U7.C15(C:MMC0_DAT3)
N$19: R16.1 U6.1(1DIR) U6.24(2DIR)
N$21: R21.1 U9.5(EN)
N$24: R14.1 U5.2(DIR)
N$28: U7.A13(C:SPI0_SCLK) U17.6(SCK)
N$29: U7.B13(C:SPI0_D0) U17.2(MISO)
N$30: U7.B14(C:SPI0_D1) U17.5(MOSI)
N$31: U7.A14(C:SPI0_CS0) U17.1(!CS)
N$33: TP30.P$1 U7.A4(C:XDMA_EVENT_INTR0)
N$34: TP180.P$1 U7.C5(C:ECAP0_IN_PWM0_OUT)
N$35: TP104.P$1 U7.T4(C:GPMC_AD8)
N$36: TP123.P$1 U7.P5(C:GPMC_AD9)
N$37: TP115.P$1 U7.R5(C:GPMC_AD10)
N$38: TP105.P$1 U7.T5(C:GPMC_AD11)
N$39: TP124.P$1 U7.P6(C:GPMC_AD12)
N$40: TP120.P$1 U7.R6(C:GPMC_AD13)
N$41: TP125.P$1 U7.N14(C:GPMC_BEN1)
N$42: TP114.P$1 U7.P15(C:GPMC_WAIT0)
N$43: TP111.P$1 U7.R16(C:GPMC_WPN)
N$44: TP177.P$1 U7.C12(C:UART0_CTSN)
N$45: TP178.P$1 U7.C13(C:UART0_RTSN)
N$46: TP162.P$1 U7.F1(D:LCD_PCLK)
N$47: TP153.P$1 U7.F3(D:LCD_VSYNC)
N$48: TP152.P$1 U7.F2(D:LCD_HSYNC)
N$49: TP159.P$1 U7.E1(D:LCD_AC_BIAS_EN)
N$50: TP143.P$1 U7.J14(D:RMII1_REF_CLK)
N$51: TP174.P$1 U7.D13(D:MDC)
N$52: TP158.P$1 U7.E13(D:MDIO)
N$53: TP147.P$1 U7.H16(D:MII1_TX_CLK)
N$54: TP137.P$1 U7.H15(D:MII1_TXD0)
N$55: TP149.P$1 U7.H14(D:MII1_TXD1)
N$56: TP135.P$1 U7.G16(D:MII1_TXD2)
N$75: TP106.P$1 U7.T7(C:GPMC_CLK)
N$76: TP100.P$1 U7.T12(C:GPMC_A0)
N$77: TP118.P$1 U7.R12(C:GPMC_A1)
N$78: TP126.P$1 U7.P12(C:GPMC_A2)
N$79: TP101.P$1 U7.T13(C:GPMC_A3)
N$80: D4.A R4.2
N$81: D3.A R3.2
N$82: TP108.P$1 U7.T15(C:GPMC_A9)
N$83: TP117.P$1 U7.R15(C:GPMC_A10)
N$84: TP103.P$1 U7.T16(C:GPMC_A11)
N$85: TP122.P$1 U7.P3(C:GPMC_CSN0)
N$86: TP107.P$1 U7.R7(C:GPMC_CSN3)
N$87: D2.A R2.2
N$93: TP134.P$1 U7.M1(C:GPMC_ADVN_ALE)
N$94: TP131.P$1 U7.N3(C:GPMC_BEN0_CLE)
N$95: TP127.P$1 U7.N2(C:GPMC_WEN)
N$96: TP128.P$1 U7.N1(C:GPMC_OEN_REN)
N$97: TP148.P$1 U7.G14(D:MII1_TX_EN)
N$105: JP105.1 R24.9
N$106: JP106.1 R24.2
N$107: JP108.3 R24.3
N$108: JP109.3 R24.6
N$109: J3.1 JP107.1 R24.8
N$110: R59.1 R60.2 U17.3(!WP)
N$111: TP69.P$1 U17.7(!HOLD)
N$535: JP105.2 U7.G3(D:LCD_DATA0)
N$578: JP106.2 U7.G2(D:LCD_DATA1)
N$582: J3.2 JP107.2 U7.G1(D:LCD_DATA2)
N$583: JP108.2 U7.H3(D:LCD_DATA3)
N$584: JP109.2 U7.H2(D:LCD_DATA4)
N$585: R25.4 U7.H1(D:LCD_DATA5)
N$586: R25.7 U7.J3(D:LCD_DATA6)
N$587: R26.4 U7.J1(D:LCD_DATA8)
N$588: R26.7 U7.K3(D:LCD_DATA9)
N$591: R26.3 U7.K2(D:LCD_DATA10)
N$592: R26.8 U7.K1(D:LCD_DATA11)
N$594: R26.2 U7.L3(D:LCD_DATA12)
N$595: R26.9 U7.L2(D:LCD_DATA13)
N$601: R24.4 U7.L1(D:LCD_DATA14)
N$602: R26.1 U7.M3(D:LCD_DATA15)
N$629: R26.6 U7.J2(D:LCD_DATA7)
N$630: JP109.1 R25.6
N$631: J3.3 JP107.3 R25.1
N$632: JP108.1 R25.9
N$633: JP106.3 R25.2
N$634: JP105.3 R25.3
N$640: C10.1 C12.1 U3.C2(VDDI)
N$641: R9.6 U3.A3(D0) U7.R3(C:GPMC_AD0)
N$642: R10.1 U3.A4(D1) U7.R2(C:GPMC_AD1)
N$643: R10.9 U3.A5(D2) U7.R1(C:GPMC_AD2)
N$644: R9.7 U3.B2(D3) U7.T3(C:GPMC_AD3)
N$645: R9.4 U3.B3(D4) U7.T2(C:GPMC_AD4)
N$646: R9.3 U3.B4(D5) U7.T1(C:GPMC_AD5)
N$647: R10.8 U3.B5(D6) U7.P4(C:GPMC_AD6)
N$648: R10.2 U3.B6(D7) U7.R4(C:GPMC_AD7)
N$649: R9.2 U3.M5(CMD) U7.P1(C:GPMC_CSN2)
N$651: R9.8 U3.M6(SCK) U7.P2(C:GPMC_CSN1)
N$652: R10.3 U3.K5(!RST!) U7.R13(C:GPMC_A4)
N$653: R2.1 U7.P13(C:GPMC_A5)
N$654: R3.1 U7.T14(C:GPMC_A6)
N$655: R4.1 U7.R14(C:GPMC_A7)
N$656: R5.1 U7.P14(C:GPMC_A8)
PIXCLK_E: J101.5 U6.20(2B6)
PIXCLK_I: TP28.P$1 U6.29(2A6) U7.B4(C:XDMA_EVENT_INTR1)
RESET: TP10.P$1 U5.19(B3) U7.D16(D:MII1_RXD1)
SADDR: TP7.P$1 U5.16(B6) U7.D15(D:MII1_RXD2)
SADDR_E: J101.27 U5.8(A6)
SCL_2: R30.2 TP37.P$1 U7.A10(C:UART1_RTSN) U9.2(SCLA)
SDA_2: R29.2 TP36.P$1 U7.B10(C:UART1_CTSN) U9.3(SDAA)
STANDBY: TP9.P$1 U5.18(B4) U7.D14(D:MII1_RXD3)
STANDBY_E: J101.25 U5.6(A4)
TRIGGER: TP6.P$1 U5.15(B7) U7.E15(D:MII1_RX_ER)
TRIGGER_E: J101.29 U5.9(A7)
UART0_RX: TP146.P$1 U7.A12(C:UART0_RXD) ; also sheet 1
UART0_TX: TP142.P$1 U7.B12(C:UART0_TXD) ; also sheet 1
VREG_EN: TP5.P$1 U5.14(B8) U7.F16(D:MII1_RX_DV)
VREG_EN_E: J101.30 U5.10(A8)
VSYNC_E: J101.3 U6.23(2B8)
VSYNC_I: TP116.P$1 U6.26(2A8) U7.T6(C:GPMC_AD14)
Unconnected: R8.1 R9.1 R9.9 R10.4 R10.6 R10.7 R24.1 R24.7 R25.8 U5.3(A1) U5.21(B1)

### Buses
CAMERA_BUS_INTERNAL:D0_I,D1_I,D2_I,D3_I,D4_I,D5_I,D6_I,D7_I,D8_I,D9_I,D10_I,D11_I,HSYNC_I,PIXCLK_I,VSYNC_I
CAMERA_BUS_EXTERNAL:D0_E,D1_E,D2_E,D3_E,D4_E,D5_E,D6_E,D7_E,D8_E,D9_E,D10_E,D11_E,HSYNC_E,PIXCLK_E,VSYNC_E
I2C_2:D3_I,SCL_2,SDA_2
CAMERA_CTL:BUS_OE,CAM_OE,CLK_EN,FLASH,INPUT_EN,RESET,SADDR,STANDBY,TRIGGER,VREG_EN

### Notes on the sheet
- CAN Transceiver
- CAN1 RX --> B11 --> UART1_TXD 
  CAN1 TX --> A11 --> UART1_RXD
- SPI Flash/EEPROM
  For SPI boot
  DNP for now
- SYSBOOT Circuit
- SD Card Circuit
  pinout from RED board
- USR LEDs
- I2C2 SCL == UART1_RTSN == A10
  I2C2 SDA == UART1_CTSN == B10
- GPIO -> PIN map
  gpio3_9   == mii1_tx_clk
  gpio0_28 == mii1_txd0
  gpio0_21 == mii1_txd1
  gpio0_17 == mii1_txd2
  gpio0_16 == mii1_txd3
  gpio3_3   == mii1_tx_en
  gpio3_1   == mii1_crs
  gpio3_0   == mii1_col
  
  gpio3_10 == mii1_rx_clk
  gpio2_21 == mii1_rxd0
  gpio2_20 == mii1_rxd1
  gpio2_19 == mii1_rxd2
  gpio2_18 == mii1_rxd3
  gpio3_2   == mii1_rx_er
  gpio3_4   == mii1_rx_dv
  
  gpio0_0   == mdio
- NOTE:
  All these signals are outputs with the
  exception of FLASH. Likewise, I put the
  outputs on GPIO2,3 and inputs on GPIO0.
  I am not sure if this is better, but it
  seemed logical
- SYSBOOT Jumper to config boot order
  must use very light pullups because 
  boot config is latched at boot and then
  the pins a used for other purposes
- eMMC Circuit
- Boot SD 
  SYSBOOT[4 : 0] == 0b11000
  SPI0 -> MMC0 -> USB0 -> UART0
  
  Boot eMMC
  SYSBOOT[4 : 0] == 0b11100
  MMC1 -> MMC0 -> UART0 -> USB0
- These capacitor values have varied slightly in
  the different designs I have looked at, but these
  values should be fine
- Default Sysboot Pins
  SYSBOOT[4 : 0] == 0b11x00
  SYSBOOT[2] HIGH == eMMC
  SYSBOOT[2] LOW == SD Card
- Need ~2.2uF here, but using two 1uF for simplicity
- SYSBOOT[15 : 5] == 0b0100_0000_000
- Unfortunately MMC0 (SD card) and the PRU share 4 pins. 
  We can get away without using them and just using the 8
  highest bits of the camera parallel bus. However, since we 
  will ultimately be booting off of eMMC, we could then utilize
  the 4 lowest bits. Likewise, populate once only the eMMc is 
  used, cut these jumpers and connect them to the PRUs
- Camera Connector and Circuitry
- 2.8V regulator
- Camera Output Level Shifter
- OE pullup to start in high Z
- I2C Transceiver
- These pullups can be populated instead of
  the optional ones on the camera board
- Camera Control Level Shifter
- OE pullup to start in high Z
- 36 Pin connector

## Sheet 4 of 5: OSD3358 USB, JTAG, XTAL, etc : SIP B
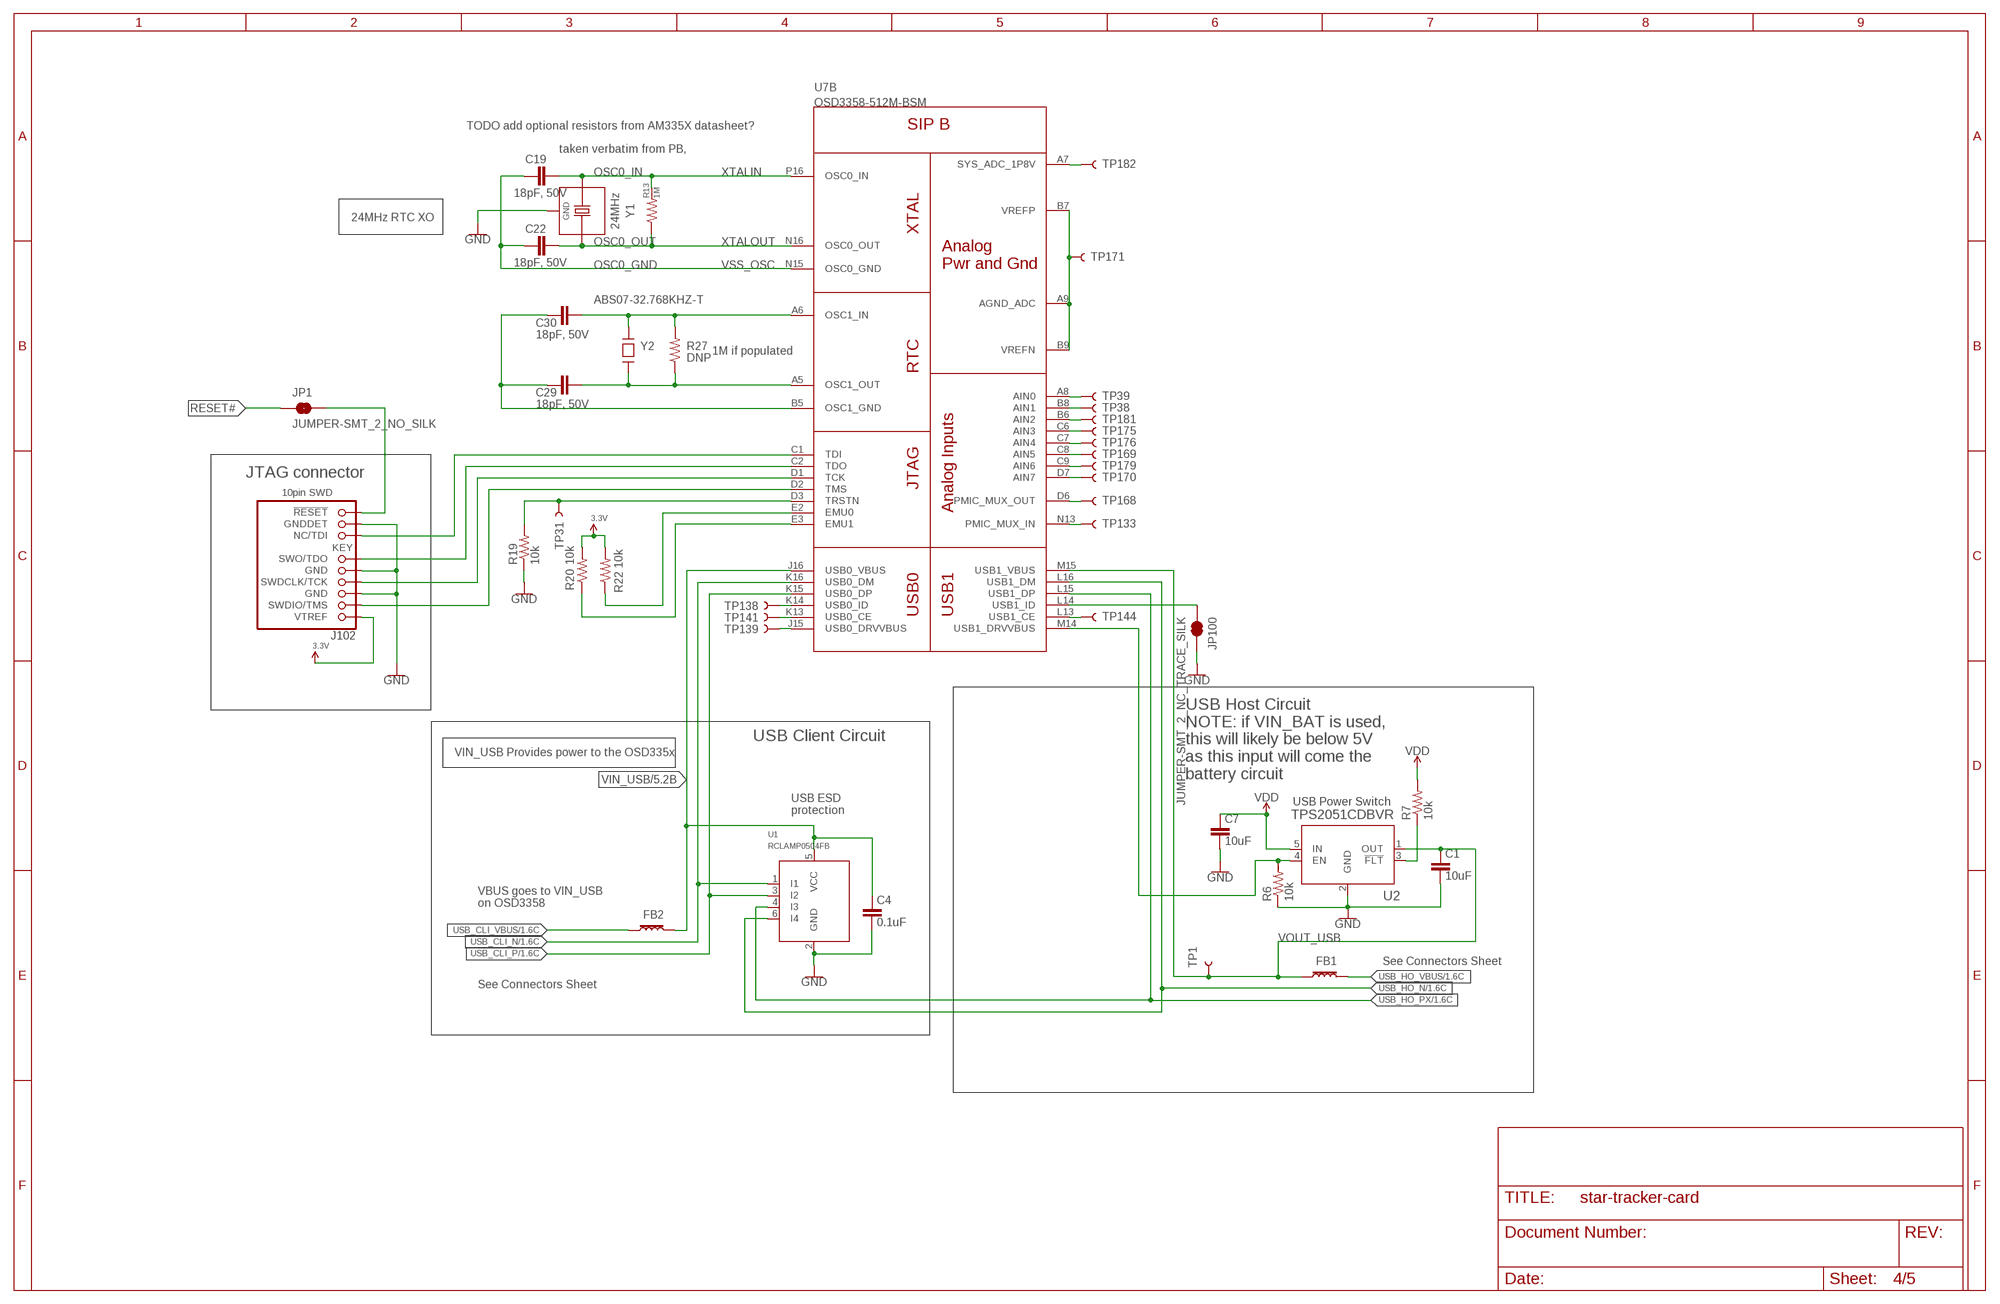
[diagram p7: schematic, sheet 4]

### Parts
C1  10uF  C-EU0805-B  [.0805-B]
C4  0.1uF  C-EU0603-A  [.0603-A]
C7  10uF  C-EU0805-B  [.0805-B]
C19  18pF, 50V  C-EU0603-A  [.0603-A]
C22  18pF, 50V  C-EU0603-A  [.0603-A]
C29  18pF, 50V  C-EU0603-A  [.0603-A]
C30  18pF, 50V  C-EU0603-A  [.0603-A]
FB1  30Ω/1.8A  FERRITE_BEAD-0603  [0603]
FB2  30Ω/1.8A  FERRITE_BEAD-0603  [0603]
J102  FTSH-105-XX-X-DV-K  [CON10_2X5_DUK_FTSH]
JP1  JUMPER-SMT_2_NO_SILK  [SMT-JUMPER_2_NO_SILK]
JP100  JUMPER-SMT_2_NC_TRACE_SILK  [SMT-JUMPER_2_NC_TRACE_SILK]
R6  10k  R-US_0603-A  [.0603-A]
R7  10k  R-US_0603-A  [.0603-A]
R13  1M  R-US_0603-A  [.0603-A]
R19  10k  R-US_0603-A  [.0603-A]
R20  10k  R-US_0603-A  [.0603-A]
R22  10k  R-US_0603-A  [.0603-A]
R27  DNP  R-US_0603-A  [.0603-A]
TP1  TEST-POINT3X4  [PAD.03X.04]
TP31  TEST-POINT3X4  [PAD.03X.04]
TP38  TEST-POINT3X4  [PAD.03X.04]
TP39  TEST-POINT3X4  [PAD.03X.04]
TP133  TEST-POINT3X4  [PAD.03X.04]
TP138  TEST-POINT3X4  [PAD.03X.04]
TP139  TEST-POINT3X4  [PAD.03X.04]
TP141  TEST-POINT3X4  [PAD.03X.04]
TP144  TEST-POINT3X4  [PAD.03X.04]
TP168  TEST-POINT3X4  [PAD.03X.04]
TP169  TEST-POINT3X4  [PAD.03X.04]
TP170  TEST-POINT3X4  [PAD.03X.04]
TP171  TEST-POINT3X4  [PAD.03X.04]
TP175  TEST-POINT3X4  [PAD.03X.04]
TP176  TEST-POINT3X4  [PAD.03X.04]
TP179  TEST-POINT3X4  [PAD.03X.04]
TP181  TEST-POINT3X4  [PAD.03X.04]
TP182  TEST-POINT3X4  [PAD.03X.04]
U1  RCLAMP0504FB  [SC70-6]
U2  TPS2051CDBVR  [DBV5]
Y1  24MHz  ECS-240-12-30BQ-AEN-TR  [5X3.2-4SMD]
Y2  ABS07-32.768KHZ-T  [CRYSTAL_3.2X1.5]

### Nets
3.3V: J102.1(VTREF) R20.2 R22.2 ; also sheet 3,5
GND: C1.2 C4.2 C7.2 J102.3(GND) J102.5(GND) J102.9(GNDDET) JP100.2 R6.1 R19.1 U1.2(GND) U2.2(GND) Y1.2(GND) Y1.4(GND) ; also sheet 1,2,3,5
N$1: TP171.P$1 U7.A9(B:AGND_ADC) U7.B7(B:VREFP) U7.B9(B:VREFN)
N$3: TP170.P$1 U7.D7(B:AIN7)
N$66: TP179.P$1 U7.C9(B:AIN6)
N$67: TP169.P$1 U7.C8(B:AIN5)
N$68: TP176.P$1 U7.C7(B:AIN4)
N$69: TP175.P$1 U7.C6(B:AIN3)
N$70: TP181.P$1 U7.B6(B:AIN2)
N$71: TP38.P$1 U7.B8(B:AIN1)
N$72: TP39.P$1 U7.A8(B:AIN0)
N$73: TP141.P$1 U7.K13(B:USB0_CE)
N$74: TP139.P$1 U7.J15(B:USB0_DRVVBUS)
N$89: TP182.P$1 U7.A7(B:SYS_ADC_1P8V)
N$90: TP168.P$1 U7.D6(B:PMIC_MUX_OUT)
N$91: R20.1 U7.E3(B:EMU1)
N$92: TP144.P$1 U7.L13(B:USB1_CE)
N$101: R22.1 U7.E2(B:EMU0)
N$102: JP100.1 U7.L14(B:USB1_ID)
N$104: TP138.P$1 U7.K14(B:USB0_ID)
N$112: J102.10(!RESET) JP1.2
N$530: J102.6(SWO/TDO) U7.C2(B:TDO)
N$533: J102.4(SWDCLK/TCK) U7.D1(B:TCK)
N$534: J102.2(SWDIO/TMS) U7.D2(B:TMS)
N$619: R6.2 U2.4(EN) U7.M14(B:USB1_DRVVBUS)
N$620: R7.1 U2.3(!FLT)
N$621: J102.8(NC/TDI) U7.C1(B:TDI)
N$657: R19.2 TP31.P$1 U7.D3(B:TRSTN)
OSC0_GND: C19.1 C22.1 U7.N15(B:OSC0_GND)
OSC0_IN: C19.2 R13.2 U7.P16(B:OSC0_IN) Y1.1(X1)
OSC0_OUT: C22.2 R13.1 U7.N16(B:OSC0_OUT) Y1.3(X2)
OSC1_GND1: C29.2 C30.2 U7.B5(B:OSC1_GND)
OSC1_IN1: C30.1 R27.2 U7.A6(B:OSC1_IN) Y2.P$2
OSC1_OUT1: C29.1 R27.1 U7.A5(B:OSC1_OUT) Y2.P$1
PMIC_MUX_IN: TP133.P$1 U7.N13(B:PMIC_MUX_IN)
RESET#: JP1.1 ; also sheet 5
USB_CLI_N: U1.1(I1) U7.K16(B:USB0_DM) ; also sheet 1
USB_CLI_P: U1.3(I2) U7.K15(B:USB0_DP) ; also sheet 1
USB_CLI_VBUS: FB2.1 ; also sheet 1
USB_HO_N: U1.6(I4) U7.L16(B:USB1_DM) ; also sheet 1
USB_HO_PX: U1.4(I3) U7.L15(B:USB1_DP) ; also sheet 1
USB_HO_VBUS: FB1.2 ; also sheet 1
VDD: C7.1 R7.2 U2.5(IN) ; also sheet 5
VIN_USB: C4.1 FB2.2 U1.5(VCC) U7.J16(B:USB0_VBUS) ; also sheet 5
VOUT_USB: C1.1 FB1.1 TP1.P$1 U2.1(OUT) U7.M15(B:USB1_VBUS)

### Notes on the sheet
- TODO add optional resistors from AM335X datasheet?
- taken verbatim from PB,
- XTALIN
- 24MHz RTC XO
- XTALOUT
- VSS_OSC
- 1M if populated
- JTAG connector
- USB Client Circuit
- VIN_USB Provides power to the OSD335x
- USB Host Circuit
  NOTE: if VIN_BAT is used,
  this will likely be below 5V
  as this input will come the 
  battery circuit
- USB Power Switch
- USB ESD
  protection
- VBUS goes to VIN_USB
  on OSD3358
- See Connectors Sheet
- See Connectors Sheet

## Sheet 5 of 5: OSD3358 PWR, ETC. : SIP A, E, F
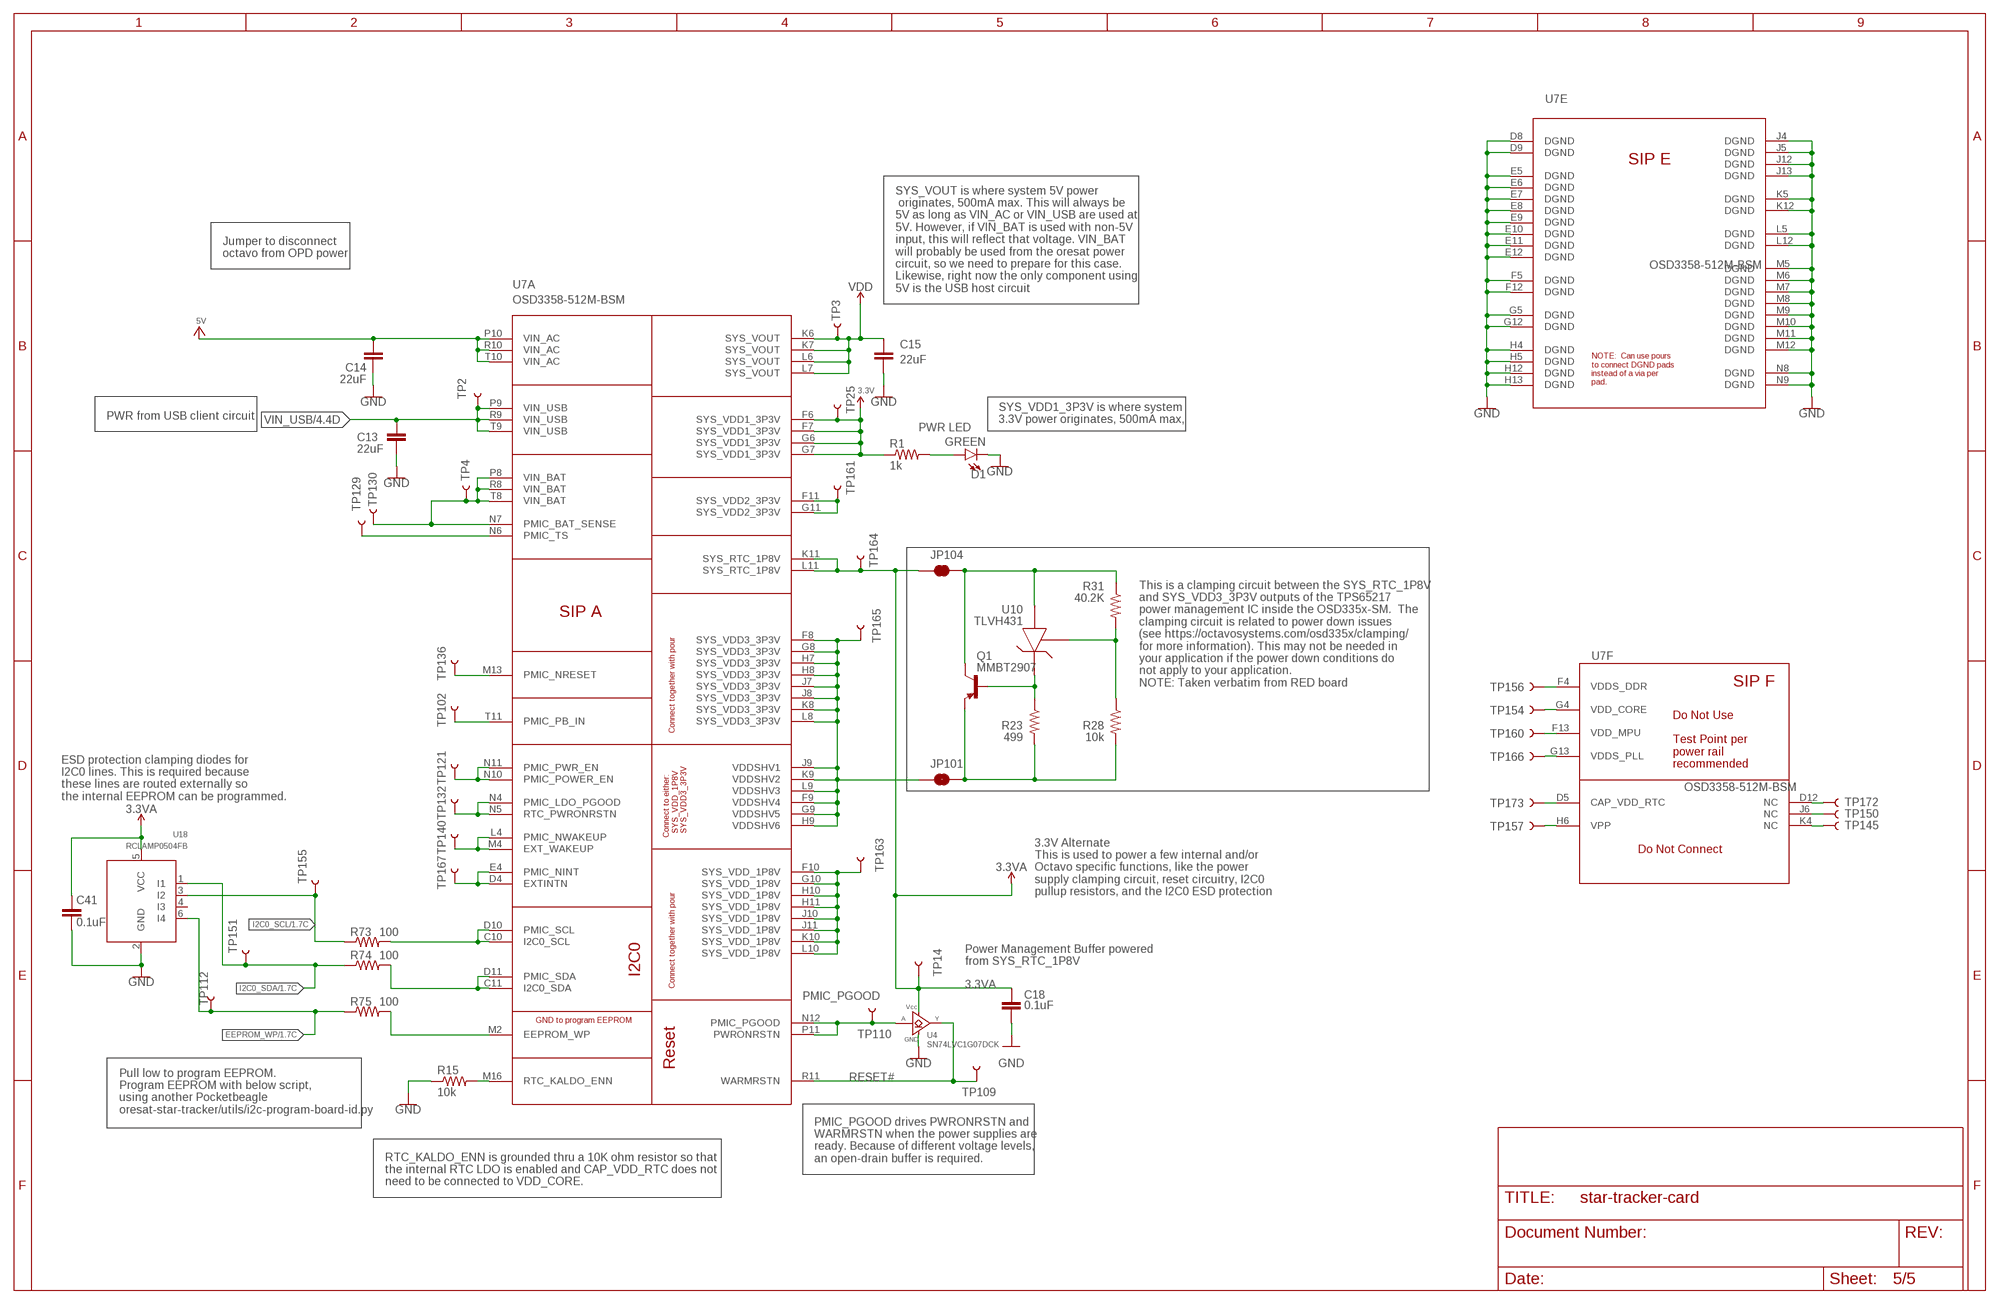
[diagram p8: schematic, sheet 5]

### Parts
C13  22uF  C-EUC1210  [C1210]
C14  22uF  C-EUC1210  [C1210]
C15  22uF  C-EUC1210  [C1210]
C18  0.1uF  C-EU0603-A  [.0603-A]
C41  0.1uF  C-EU0603-A  [.0603-A]
D1  GREEN  LED-GREEN0603  [LED-0603]
JP101  JUMPER-SMT_2_NC_TRACE_SILK  [SMT-JUMPER_2_NC_TRACE_SILK]
JP104  JUMPER-SMT_2_NC_TRACE_SILK  [SMT-JUMPER_2_NC_TRACE_SILK]
Q1  MMBT2907  MMBT2907SMD  [SOT23-BEC]
R1  1k  R-US_0603-A  [.0603-A]
R15  10k  R-US_0603-A  [.0603-A]
R23  499  R-US_0603-A  [.0603-A]
R28  10k  R-US_0603-A  [.0603-A]
R31  40.2K  R-US_0603-A  [.0603-A]
R73  100  R-US_0603-A  [.0603-A]
R74  100  R-US_0603-A  [.0603-A]
R75  100  R-US_0603-A  [.0603-A]
TP2  TEST-POINT3X4  [PAD.03X.04]
TP3  TEST-POINT3X4  [PAD.03X.04]
TP4  TEST-POINT3X4  [PAD.03X.04]
TP14  TEST-POINT3X4  [PAD.03X.04]
TP25  TEST-POINT3X4  [PAD.03X.04]
TP102  TEST-POINT3X4  [PAD.03X.04]
TP109  TEST-POINT3X4  [PAD.03X.04]
TP110  TEST-POINT3X4  [PAD.03X.04]
TP112  TEST-POINT3X4  [PAD.03X.04]
TP121  TEST-POINT3X4  [PAD.03X.04]
TP129  TEST-POINT3X4  [PAD.03X.04]
TP130  TEST-POINT3X4  [PAD.03X.04]
TP132  TEST-POINT3X4  [PAD.03X.04]
TP136  TEST-POINT3X4  [PAD.03X.04]
TP140  TEST-POINT3X4  [PAD.03X.04]
TP145  TEST-POINT3X4  [PAD.03X.04]
TP150  TEST-POINT3X4  [PAD.03X.04]
TP151  TEST-POINT3X4  [PAD.03X.04]
TP154  TEST-POINT3X4  [PAD.03X.04]
TP155  TEST-POINT3X4  [PAD.03X.04]
TP156  TEST-POINT3X4  [PAD.03X.04]
TP157  TEST-POINT3X4  [PAD.03X.04]
TP160  TEST-POINT3X4  [PAD.03X.04]
TP161  TEST-POINT3X4  [PAD.03X.04]
TP163  TEST-POINT3X4  [PAD.03X.04]
TP164  TEST-POINT3X4  [PAD.03X.04]
TP165  TEST-POINT3X4  [PAD.03X.04]
TP166  TEST-POINT3X4  [PAD.03X.04]
TP167  TEST-POINT3X4  [PAD.03X.04]
TP172  TEST-POINT3X4  [PAD.03X.04]
TP173  TEST-POINT3X4  [PAD.03X.04]
U4  SN74LVC1G07DCK  [C70(TI-DCK)]
U10  TLVH431  [SOT23-3]
U18  RCLAMP0504FB  [SC70-6]

### Nets
3.3V: R1.1 TP25.P$1 U7.F6(A:SYS_VDD1_3P3V) U7.F7(A:SYS_VDD1_3P3V) U7.G6(A:SYS_VDD1_3P3V) U7.G7(A:SYS_VDD1_3P3V) ; also sheet 3,4
3.3VA: C18.1 C41.1 JP104.1 TP14.P$1 TP164.P$1 U4.5(VCC) U7.K11(A:SYS_RTC_1P8V) U7.L11(A:SYS_RTC_1P8V) U18.5(VCC)
5V: C14.1 U7.P10(A:VIN_AC) U7.R10(A:VIN_AC) U7.T10(A:VIN_AC) ; also sheet 2
EEPROM_WP: R75.1 TP112.P$1 U18.6(I4) ; also sheet 1
GND: C13.2 C14.2 C15.2 C18.2 C41.2 D1.C R15.1 U4.3(GND) U7.D8(E:DGND) U7.D9(E:DGND) U7.E5(E:DGND) U7.E6(E:DGND) U7.E7(E:DGND) U7.E8(E:DGND) U7.E9(E:DGND) U7.E10(E:DGND) U7.E11(E:DGND) U7.E12(E:DGND) U7.F5(E:DGND) U7.F12(E:DGND) U7.G5(E:DGND) U7.G12(E:DGND) U7.H4(E:DGND) U7.H5(E:DGND) U7.H12(E:DGND) U7.H13(E:DGND) U7.J4(E:DGND) U7.J5(E:DGND) U7.J12(E:DGND) U7.J13(E:DGND) U7.K5(E:DGND) U7.K12(E:DGND) U7.L5(E:DGND) U7.L12(E:DGND) U7.M5(E:DGND) U7.M6(E:DGND) U7.M7(E:DGND) U7.M8(E:DGND) U7.M9(E:DGND) U7.M10(E:DGND) U7.M11(E:DGND) U7.M12(E:DGND) U7.N8(E:DGND) U7.N9(E:DGND) U18.2(GND) ; also sheet 1,2,3,4
I2C0_SCL: R73.1 TP155.P$1 U18.3(I2) ; also sheet 1
I2C0_SDA: R74.1 TP151.P$1 U18.1(I1) ; also sheet 1
N$20: JP101.2 Q1.E R23.2 R28.2
N$22: R28.1 R31.2 U10.1(REF)
N$23: Q1.B R23.1 U10.2(CATHODE)
N$26: JP101.1 TP165.P$1 U7.F8(A:SYS_VDD3_3P3V) U7.F9(A:VDDSHV4) U7.G8(A:SYS_VDD3_3P3V) U7.G9(A:VDDSHV5) U7.H7(A:SYS_VDD3_3P3V) U7.H8(A:SYS_VDD3_3P3V) U7.H9(A:VDDSHV6) U7.J7(A:SYS_VDD3_3P3V) U7.J8(A:SYS_VDD3_3P3V) U7.J9(A:VDDSHV1) U7.K8(A:SYS_VDD3_3P3V) U7.K9(A:VDDSHV2) U7.L8(A:SYS_VDD3_3P3V) U7.L9(A:VDDSHV3)
N$57: TP172.P$1 U7.D12(F:NC)
N$58: TP150.P$1 U7.J6(F:NC)
N$59: TP145.P$1 U7.K4(F:NC)
N$60: TP157.P$1 U7.H6(F:VPP)
N$61: TP173.P$1 U7.D5(F:CAP_VDD_RTC)
N$62: TP166.P$1 U7.G13(F:VDDS_PLL)
N$63: TP160.P$1 U7.F13(F:VDD_MPU)
N$64: TP154.P$1 U7.G4(F:VDD_CORE)
N$65: TP156.P$1 U7.F4(F:VDDS_DDR)
N$88: D1.A R1.2
N$114: R74.2 U7.C11(A:I2C0_SDA) U7.D11(A:PMIC_SDA)
N$115: R75.2 U7.M2(A:EEPROM_WP)
N$116: R73.2 U7.C10(A:I2C0_SCL) U7.D10(A:PMIC_SCL)
N$401: TP4.P$1 TP130.P$1 U7.N7(A:PMIC_BAT_SENSE) U7.P8(A:VIN_BAT) U7.R8(A:VIN_BAT) U7.T8(A:VIN_BAT)
N$404: TP129.P$1 U7.N6(A:PMIC_TS)
N$405: TP161.P$1 U7.F11(A:SYS_VDD2_3P3V) U7.G11(A:SYS_VDD2_3P3V)
N$407: JP104.2 Q1.C R31.1 U10.3(ANODE)
N$499: TP163.P$1 U7.F10(A:SYS_VDD_1P8V) U7.G10(A:SYS_VDD_1P8V) U7.H10(A:SYS_VDD_1P8V) U7.H11(A:SYS_VDD_1P8V) U7.J10(A:SYS_VDD_1P8V) U7.J11(A:SYS_VDD_1P8V) U7.K10(A:SYS_VDD_1P8V) U7.L10(A:SYS_VDD_1P8V)
N$504: TP167.P$1 U7.D4(A:EXTINTN) U7.E4(A:PMIC_NINT)
N$519: TP140.P$1 U7.L4(A:PMIC_NWAKEUP) U7.M4(A:EXT_WAKEUP)
N$520: TP132.P$1 U7.N4(A:PMIC_LDO_PGOOD) U7.N5(A:RTC_PWRONRSTN)
N$524: TP121.P$1 U7.N10(A:PMIC_POWER_EN) U7.N11(A:PMIC_PWR_EN)
N$525: TP102.P$1 U7.T11(A:PMIC_PB_IN)
N$529: TP136.P$1 U7.M13(A:PMIC_NRESET)
N$609: R15.2 U7.M16(A:RTC_KALDO_ENN)
PMIC_PGOOD: TP110.P$1 U4.2(A) U7.N12(A:PMIC_PGOOD) U7.P11(A:PWRONRSTN)
RESET#: TP109.P$1 U4.4(Y) U7.R11(A:WARMRSTN) ; also sheet 4
VDD: C15.1 TP3.P$1 U7.K6(A:SYS_VOUT) U7.K7(A:SYS_VOUT) U7.L6(A:SYS_VOUT) U7.L7(A:SYS_VOUT) ; also sheet 4
VIN_USB: C13.1 TP2.P$1 U7.P9(A:VIN_USB) U7.R9(A:VIN_USB) U7.T9(A:VIN_USB) ; also sheet 4
Unconnected: U18.4(I3)

### Notes on the sheet
- Jumper to disconnect 
  octavo from OPD power
- SYS_VOUT is where system 5V power
   originates, 500mA max. This will always be 
  5V as long as VIN_AC or VIN_USB are used at
  5V. However, if VIN_BAT is used with non-5V
  input, this will reflect that voltage. VIN_BAT
  will probably be used from the oresat power
  circuit, so we need to prepare for this case.
  Likewise, right now the only component using 
  5V is the USB host circuit
- PWR from USB client circuit
- SYS_VDD1_3P3V is where system 
  3.3V power originates, 500mA max,
- PWR LED
- This is a clamping circuit between the SYS_RTC_1P8V 
  and SYS_VDD3_3P3V outputs of the TPS65217
  power management IC inside the OSD335x-SM.  The
  clamping circuit is related to power down issues 
  (see https://octavosystems.com/osd335x/clamping/ 
  for more information). This may not be needed in 
  your application if the power down conditions do 
  not apply to your application.
  NOTE: Taken verbatim from RED board
- ESD protection clamping diodes for
  I2C0 lines. This is required because
  these lines are routed externally so
  the internal EEPROM can be programmed.
- 3.3V Alternate
  This is used to power a few internal and/or 
  Octavo specific functions, like the power
  supply clamping circuit, reset circuitry, I2C0
  pullup resistors, and the I2C0 ESD protection
- Power Management Buffer powered
  from SYS_RTC_1P8V
- Pull low to program EEPROM.
  Program EEPROM with below script,
  using another Pocketbeagle
  oresat-star-tracker/utils/i2c-program-board-id.py
- PMIC_PGOOD drives PWRONRSTN and
  WARMRSTN when the power supplies are
  ready. Because of different voltage levels,
  an open-drain buffer is required.
- RTC_KALDO_ENN is grounded thru a 10K ohm resistor so that 
  the internal RTC LDO is enabled and CAP_VDD_RTC does not 
  need to be connected to VDD_CORE.

## Library data of the parts
C1-C32 C34-C44 = oresat-rcl:C-EU: CAPACITOR, European symbol
C33 = oresat-rcl:C-EU: CAPACITOR, European symbol; DIS: Digi-Key; DPN: 1276-1001-1-ND; MFR: Samsung; MPN: CL05B104KO5NNNC
D1 D7 D8 = SparkFun-LED:LED-GREEN: Green SMD LED Used in manufacturing of various products at SparkFun Packages: 0603 - SMD 0603 package [Product Link] <http://www.futureelectronics.com/en/technologies/semiconductors/optoelectronics/leds/Pages/9894312-LTST-C190GKT.aspx?CrossPart=HSMG-C190&IM=0> LilyPad 1206 - SMD1206 LilyPad package [Product Link] <http://www.futureelectronics.com/en/Technologies/Product.aspx?ProductID=IN150NGHARVATEKCORPORATION2049943&IM=0> 1206 - SMD1206 package [Product Link] <http://www.futureelectronics.com/en/technologies/semiconductors/optoelectronics/leds/Pages/8315665-LTST-C150KGKT.aspx?IM=0> 1206 Bottom Mount -SMD 1206 Bottom Mount [Product Link] <http://www.digikey.com/product-detail/en/lite-on-inc/LTST-C230KGKT/160-1456-1-ND/386854> SparkFun Products: Pro Mini 328 -5V <https://www.sparkfun.com/products/821> RedBoard <https://www.sparkfun.com/products/12757> MP3 Trigger <https://www.sparkfun.com/products/13720> Makey Makey <https://www.sparkfun.com/products/11076>; PROD_ID: DIO-00821
D2-D5 = SparkFun-LED:LED-BLUE: Blue SMD LED Used in manufacturing of various products at SparkFun Packages: 0603 - SMD 0603 package [Product Link] <http://www.digikey.com/product-detail/en/SMLE12BC7TT86/511-1589-2-ND/1641808> 1206 - SMD1206 package [Product Link] <http://www.digikey.com/product-detail/en/lite-on-inc/LTST-C150TBKT/160-1643-1-ND/573584> SparkFun Products: ESP8266 Thing-Dev Board <https://www.sparkfun.com/products/13711> RedBoard <https://www.sparkfun.com/products/12757>; PROD_ID: DIO-08575
D6 = SparkFun-LED:LED-GREEN: Green SMD LED Used in manufacturing of various products at SparkFun Packages: 0603 - SMD 0603 package [Product Link] <http://www.futureelectronics.com/en/technologies/semiconductors/optoelectronics/leds/Pages/9894312-LTST-C190GKT.aspx?CrossPart=HSMG-C190&IM=0> LilyPad 1206 - SMD1206 LilyPad package [Product Link] <http://www.futureelectronics.com/en/Technologies/Product.aspx?ProductID=IN150NGHARVATEKCORPORATION2049943&IM=0> 1206 - SMD1206 package [Product Link] <http://www.futureelectronics.com/en/technologies/semiconductors/optoelectronics/leds/Pages/8315665-LTST-C150KGKT.aspx?IM=0> 1206 Bottom Mount -SMD 1206 Bottom Mount [Product Link] <http://www.digikey.com/product-detail/en/lite-on-inc/LTST-C230KGKT/160-1456-1-ND/386854> SparkFun Products: Pro Mini 328 -5V <https://www.sparkfun.com/products/821> RedBoard <https://www.sparkfun.com/products/12757> MP3 Trigger <https://www.sparkfun.com/products/13720> Makey Makey <https://www.sparkfun.com/products/11076>; VALUE: GREEN
FB1 FB2 = SparkFun-Coils:FERRITE_BEAD: Ferrite Bead (blocks, cores, rings, chokes, etc.) Inductor with layers of ferrite used to suppress high frequencies. Often used to isolate high frequency noise. SparkFun Products: IOIO-OTG - V2.2 <https://www.sparkfun.com/products/13613> SparkFun SAMD21 Mini Breakout <https://www.sparkfun.com/products/13664> SparkFun 6 Degrees of Freedom Breakout - LSM6DS3 <https://www.sparkfun.com/products/13339> SparkFun SAMD21 Dev Breakout <https://www.sparkfun.com/products/13672>; DPN: 490-14027-1-ND; MPN: BLM18KG300JH1D; PROD_ID: NDUC-13805
J1 = oresat-debug-connector:ORESAT-DEBUG-CONNECTOR; DPN: A100287CT-ND; MPN: 2-1734592-0
J3 = SparkFun-Connectors:CONN_03: Multi connection point. Often used as Generic Header-pin footprint for 0.1 inch spaced/style header connections On any of the 0.1 inch spaced packages, you can populate with these: Break Away Headers - Straight <https://www.sparkfun.com/products/116> (PRT-00116) Break Away Male Headers - Right Angle <https://www.sparkfun.com/products/553> (PRT-00553) Female Headers <https://www.sparkfun.com/products/115> (PRT-00115) Break Away Headers - Machine Pin <https://www.sparkfun.com/products/117> (PRT-00117) Break Away Female Headers - Swiss Machine Pin <https://www.sparkfun.com/products/743> (PRT-00743) Stackable Header - 3 Pin (Female, 0.1") <https://www.sparkfun.com/products/13875> (PRT-13875) For SCREWTERMINALS and SPRING TERMINALS visit here: Screw Terimnals on SparkFun.com <https://www.sparkfun.com/search/results?term=Screw+Terminals> (5mm/3.5mm/2.54mm spacing) This device is also useful as a general connection point to wire up your design to another part of your project. Our various solder wires solder well into these plated through hole pads. Hook-Up Wire - Assortment (Stranded, 22 AWG) <https://www.sparkfun.com/products/11375> (PRT-11375) Hook-Up Wire - Assortment (Solid Core, 22 AWG) <https://www.sparkfun.com/products/11367> (PRT-11367) View the entire wire category on our website here <https://www.sparkfun.com/categories/141> Special notes: Molex polarized connector foot print use with SKU : PRT-08232 with associated crimp pins and housings.
J4 = J-Samtec-TFM-120-X1-XXX-D-RA:J-SAMTEC-TFM-120-X1-XXX-D-RA; DPN: SAM10145-ND; MPN: TFM-120-01-L-D-RA
J100 = J-Hirose-DM3BT-DSF-PEJS:DM3BT-DSF-PEJS: HIROSE - microSD Card socket - Reverse on-Board - Push / Push; DPN: DM3BT-DSF-PEJS; MPN: DM3BT-DSF-PEJS
J101 = J-TEConnectivity-X-1734592-X:3-1734592-6; DPN: A100291CT-ND; MPN: 3-1734592-6
J102 = J-Samtec-FTSH-105-XXX-DV-K-ARM-SWD:FTSH-105-XX-X-DV-K
JP1 = SparkFun-Jumpers:JUMPER-SMT_2_NO: Normally open jumper This jumper has two pads in close proximity to each other. Apply solder to close the connection. Round pads are easier to solder for beginners, but are a lot larger. SparkFun Product that uses the round pads: SparkFun EL Sequencer <https://www.sparkfun.com/products/12781>
JP100 JP101 JP104 = SparkFun-Jumpers:JUMPER-SMT_2_NC_TRACE: Normally closed trace jumper This jumper has a trace between two pads so it's normally closed (NC). Use a razor knife to open the connection. For best results follow the IPC guidelines for cutting traces: Cutout at least 0.063 mm (0.005 in). Remove all loose material to clean up the cut area. Seal the cut with an approved epoxy. Reapply solder to reclose the connection.
JP102 JP103 JP105 JP106 JP108-JP111 = SparkFun-Jumpers:JUMPER-SMT_3_1-NC_TRACE: Normally closed trace jumper (1 of 2 connections) This jumper has a trace between two pads so it's normally closed (NC). The other connection is normally open (NO). Use a razor knife to open the connection. For best results follow the IPC guidelines for cutting traces: Cutout at least 0.063 mm (0.005 in). Remove all loose material to clean up the cut area. Seal the cut with an approved epoxy. Reapply solder to reclose the connection, or to close the NO connection.
JP107 = SparkFun-Jumpers:JUMPER-SMT_3_NO: Normally open jumper This jumper has three pads in close proximity to each other. Apply solder to close the connection(s).
L1 = L-ECS-MPI4040:L-ECS-MPI4040; DPN: XC2337CT-ND; MPN: ECS-MPI4040R4-6R8-R
PCB1 = oresat-cards:ORESAT-CARD-V1.3-STAR-TRACKER: Star Tracker Outline for OreSat Card v1.3. This version uses the two sided camera grab; note that there's no need for 1.3 mm keepouts near the card edges since the camer card must go in the center slot of the "U" due to the solar panel cutouts.
Q1 = Q-Diodesinc-MMBT2907-PNP:MMBT2907*: PNP Transistror; DPN: MMBT2907A-FDICT-ND; MPN: MMBT2907A-7-F
Q2 Q4 = Tova:PMV45EN; DPN: 1727-2307-1-ND; MPN: PMV45EN2R
Q3 = Q-MOSFET-PCH-dual-SOT23-6:MOSFET-PCH-SOT23-6: Dual P channel MOSFETs in an SOT23-6; DPN: DMP2240UDMDICT-ND; MPN: DMP2240UDM-7
Q5 Q6 = Q-MOSFET-PCH-SOT23-6:MOSFET-PCH-SOT23-6: P channel MOSFET in an SOT23-6; DPN: DMP3050LVT-7DICT-ND; MPN: DMP3050LVT-7
R1-R7 R11-R23 R27-R32 R34-R37 R39 R41 R43-R50 R52 R59-R62 R64 R71-R75 = oresat-rcl:R-US_: RESISTOR, American symbol
R8-R10 = R-Panasonic-EXB_A10PXXXJ:EXB-A10P391J; DPN: U7103CT-ND; MFR: Panasonic Electronic Components; MPN: EXB-A10P103J
R24-R26 = R-Panasonic-EXB_A10PXXXJ:EXB-A10P391J; DPN: U7104CT-ND; MFR: Panasonic Electronic Components; MPN: EXB-A10P104J
R33 R38 R40 R42 R51 R53-R58 R65-R70 = oresat-rcl:R-US_: RESISTOR, American symbol; DIS: Digi-Key; DPN: 1276-4275-1-ND; MFR: Samsung; MPN: RC1005F6653CS
R63 = rcl:R-US_: RESISTOR, American symbol; SPICEPREFIX: R
TP1-TP31 TP35-TP40 TP58-TP62 TP69 TP100-TP184 = SparkFun-Connectors:TEST-POINT: SparkFun Test Points Bare copper test points for troubleshooting or In-Circuit-Testing. These are used by our Production team for verifying production board runs using pogo-pins on test beds. SparkFun Products: SparkFun LSM9DS1 Breakout <https://www.sparkfun.com/products/13284> SparkFun PSOC <https://www.sparkfun.com/products/13714> SparkFun Load Cell Amplifier <https://www.sparkfun.com/products/13879>
TP41-TP57 TP63-TP68 = Tova:TEST-POINT
U1 U18 = U-Semtec-RCLAMP0504FB:RCLAMP0504FB; DPN: RCLAMP0504FBTCTCT-ND; MPN: RCLAMP0504FBTCT
U2 = U-TI-TPS2051C:TPS2051CDBVR; DPN: 296-29537-1-ND; MFR: Texas Instruments; MPN: TPS2051CDBVR
U3 = U-Generic-eMMC-153pin:EMMC+RESET+5.1-COMPATIBLE: eMMC (embedded multi-media card) memory with optional Reset function NOTE: The only way this differs from the other package is that J5 is connected to VSS, per JEDEC eMMC 5.1 spec; DPN: THGBMJG7C2LBAU8-ND; MPN: THGBMJG7C2LBAU8
U4 = U-TI-SN74LVC1G07DCK-Buffer:SN74LVC1G07DCK; DPN: 296-8486-1-ND; MPN: SN74LVC1G07DCKR
U5 = U-TI-SN74LVC8T245MPWREP-8bit-TRX:SN74LVC8T245MPWREP; DPN: 296-24003-1-ND; MPN: ‎SN74LVC8T245MPWREP‎
U6 = U-TI-CLVCH16T245MDGxREP-16bit-TRX:CLVCH16T245MDGGREP; DPN: 296-23948-1-ND; MPN: CLVCH16T245MDGGREP
U7 = U-OSD3358-512M-BSM:OSD3358-512M-BSM: Octavo Systems LLC OSD335x Family SiP: 21mm x 21mm, 1.27mm pitch 256 pin BGA contains AM3358, 512MB DDR3, TPS65217, TL5209, 4KB EEPROM and passives. Commerical Temperature (case): 0C to 85C.; DPN: 1676-1002-ND; MFR: Octavo Systems; MPN: OSD3358-512M-BSM; PACKAGE: BGA-400 Octavo Systems
U8 = U-TI-TLV70028QDDCRQ1-VoltageReg:TLV70028QDDCRQ1; DPN: 296-39280-1-ND; MPN: TLV70028DDCR
U9 = U-TI-TCA9509DGKR-I2C_repeater:TCA9509DGKR; DPN: 296-30283-1-ND; MFR: Texas Instruments; MPN: TCA9509DGKR
U10 = U-TI-TLVH431-Shunt-Regulator:TLVH431; DPN: 296-36778-1-ND; MPN: TLVH431BQDBZRQ1
U11 = U-TI-TCAN330-CAN-transceiver:TCAN330; DPN: 296-44211-1-ND; MPN: TCAN330GDCNT
U12 U13 = U-Microchip-MIC842-Comparator:MIC842L; DPN: 576-2927-1-ND; MPN: MIC842LYC5
U14 = U-Maxim-MAX4211-power-monitor:MAX4211; DPN: MAX4211FETE+-ND; MPN: MAX4211FETE+
U15 = U-TI-TPS6211x-SPS-buck:TPS6211X: TPS6211x 17-V, 1.5-A, Synchronous Step-Down Converter; DPN: 296-39444-1-ND; MPN: TPS62112RSAR
U16 = U-Maxim-MAX7310-I2C-GPIO-expander:MAX7310; DPN: MAX7310ATE+-ND; MFR: Maxim; MPN: MAX7310ATE
U17 = U-Generic-SPI-EEPROM:25AAXX; MPN: 25AA02E48T-I/SN
Y1 = X-ECS-240-12-30BQ-AEN-TR:ECS-240-12-30BQ-AEN-TR; DPN: XC2580CT-ND; MPN: ECS-240-12-30BQ-AEN-TR
Y2 = OSD3358-SM-RED Platform:ABS07-32.768KHZ-T: 32kHz crystal; DPN: 535-9542-1-ND; MPN: ABS07-32.768KHZ-T

## Net classes
1 diff pair: width 0.191 mm, clearance 0.191 mm